# EAGLE design MotorControllerMainBoard (EAGLE 8.3.2)

## Sheet 1 of 7: Main Board Topology
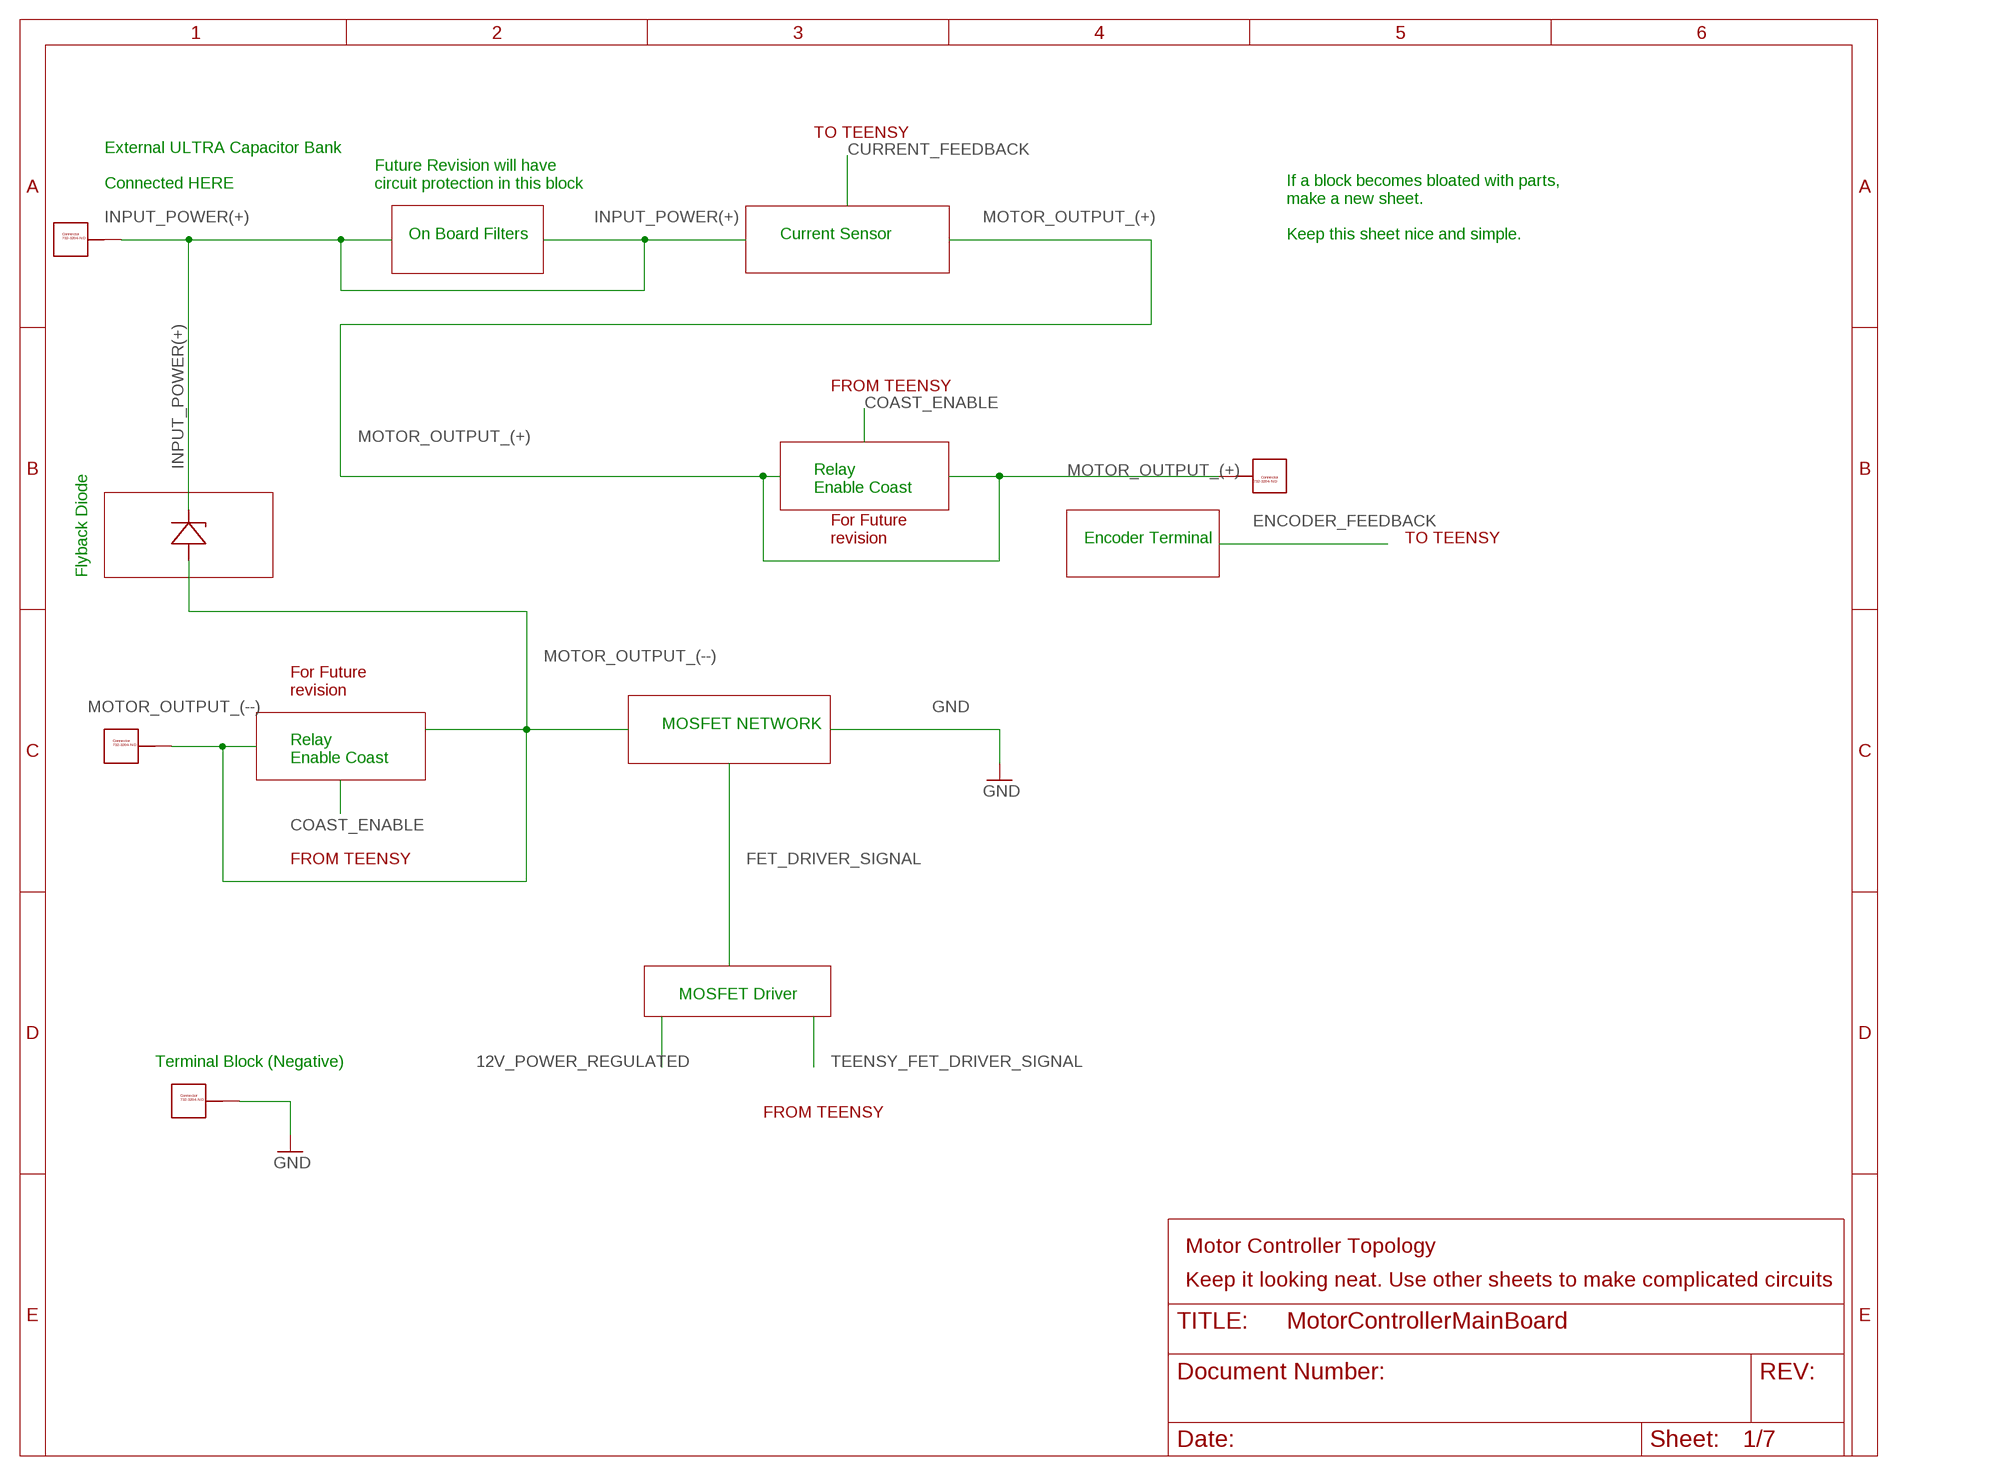
[diagram p0: schematic, sheet 1]

### Parts
U$5  FLYBACK  [TO]
U$12  732-3204-ND_CONNECTOR  [732-3204-ND]
U$14  732-3204-ND_CONNECTOR  [732-3204-ND]
U$15  732-3204-ND_CONNECTOR  [732-3204-ND]
U$16  732-3204-ND_CONNECTOR  [732-3204-ND]

### Nets
GND: U$14.P$1 U$14.P$2 U$14.P$3 U$14.P$4 U$14.P$5 U$14.P$6 U$14.P$7 U$14.P$8 U$14.P$9 U$14.P$10 ; also sheet 2,3,4,5,6,7
INPUT_POWER(+): U$5.CATHODE U$12.P$1 U$12.P$2 U$12.P$3 U$12.P$4 U$12.P$5 U$12.P$6 U$12.P$7 U$12.P$8 U$12.P$9 U$12.P$10 ; also sheet 6,7
MOTOR_OUTPUT_(+): U$15.P$1 U$15.P$2 U$15.P$3 U$15.P$4 U$15.P$5 U$15.P$6 U$15.P$7 U$15.P$8 U$15.P$9 U$15.P$10 ; also sheet 4,5
MOTOR_OUTPUT_(--): U$5.ANODE U$16.P$1 U$16.P$2 U$16.P$3 U$16.P$4 U$16.P$5 U$16.P$6 U$16.P$7 U$16.P$8 U$16.P$9 U$16.P$10 ; also sheet 2

### Notes on the sheet
- TO TEENSY
- External ULTRA Capacitor Bank 
  
  Connected HERE
- Future Revision will have 
  circuit protection in this block
- On Board Filters | Current Sensor
- If a block becomes bloated with parts,
  make a new sheet. 
  
  Keep this sheet nice and simple.
- FROM TEENSY
- Relay
  Enable Coast
- For Future
  revision
- Encoder Terminal | TO TEENSY
- Flyback Diode
- For Future
  revision
- MOSFET NETWORK
- Relay
  Enable Coast
- FROM TEENSY
- MOSFET Driver
- Terminal Block (Negative)
- FROM TEENSY
- Motor Controller Topology
- Keep it looking neat. Use other sheets to make complicated circuits

## Sheet 2 of 7: MOSFET NETWORK
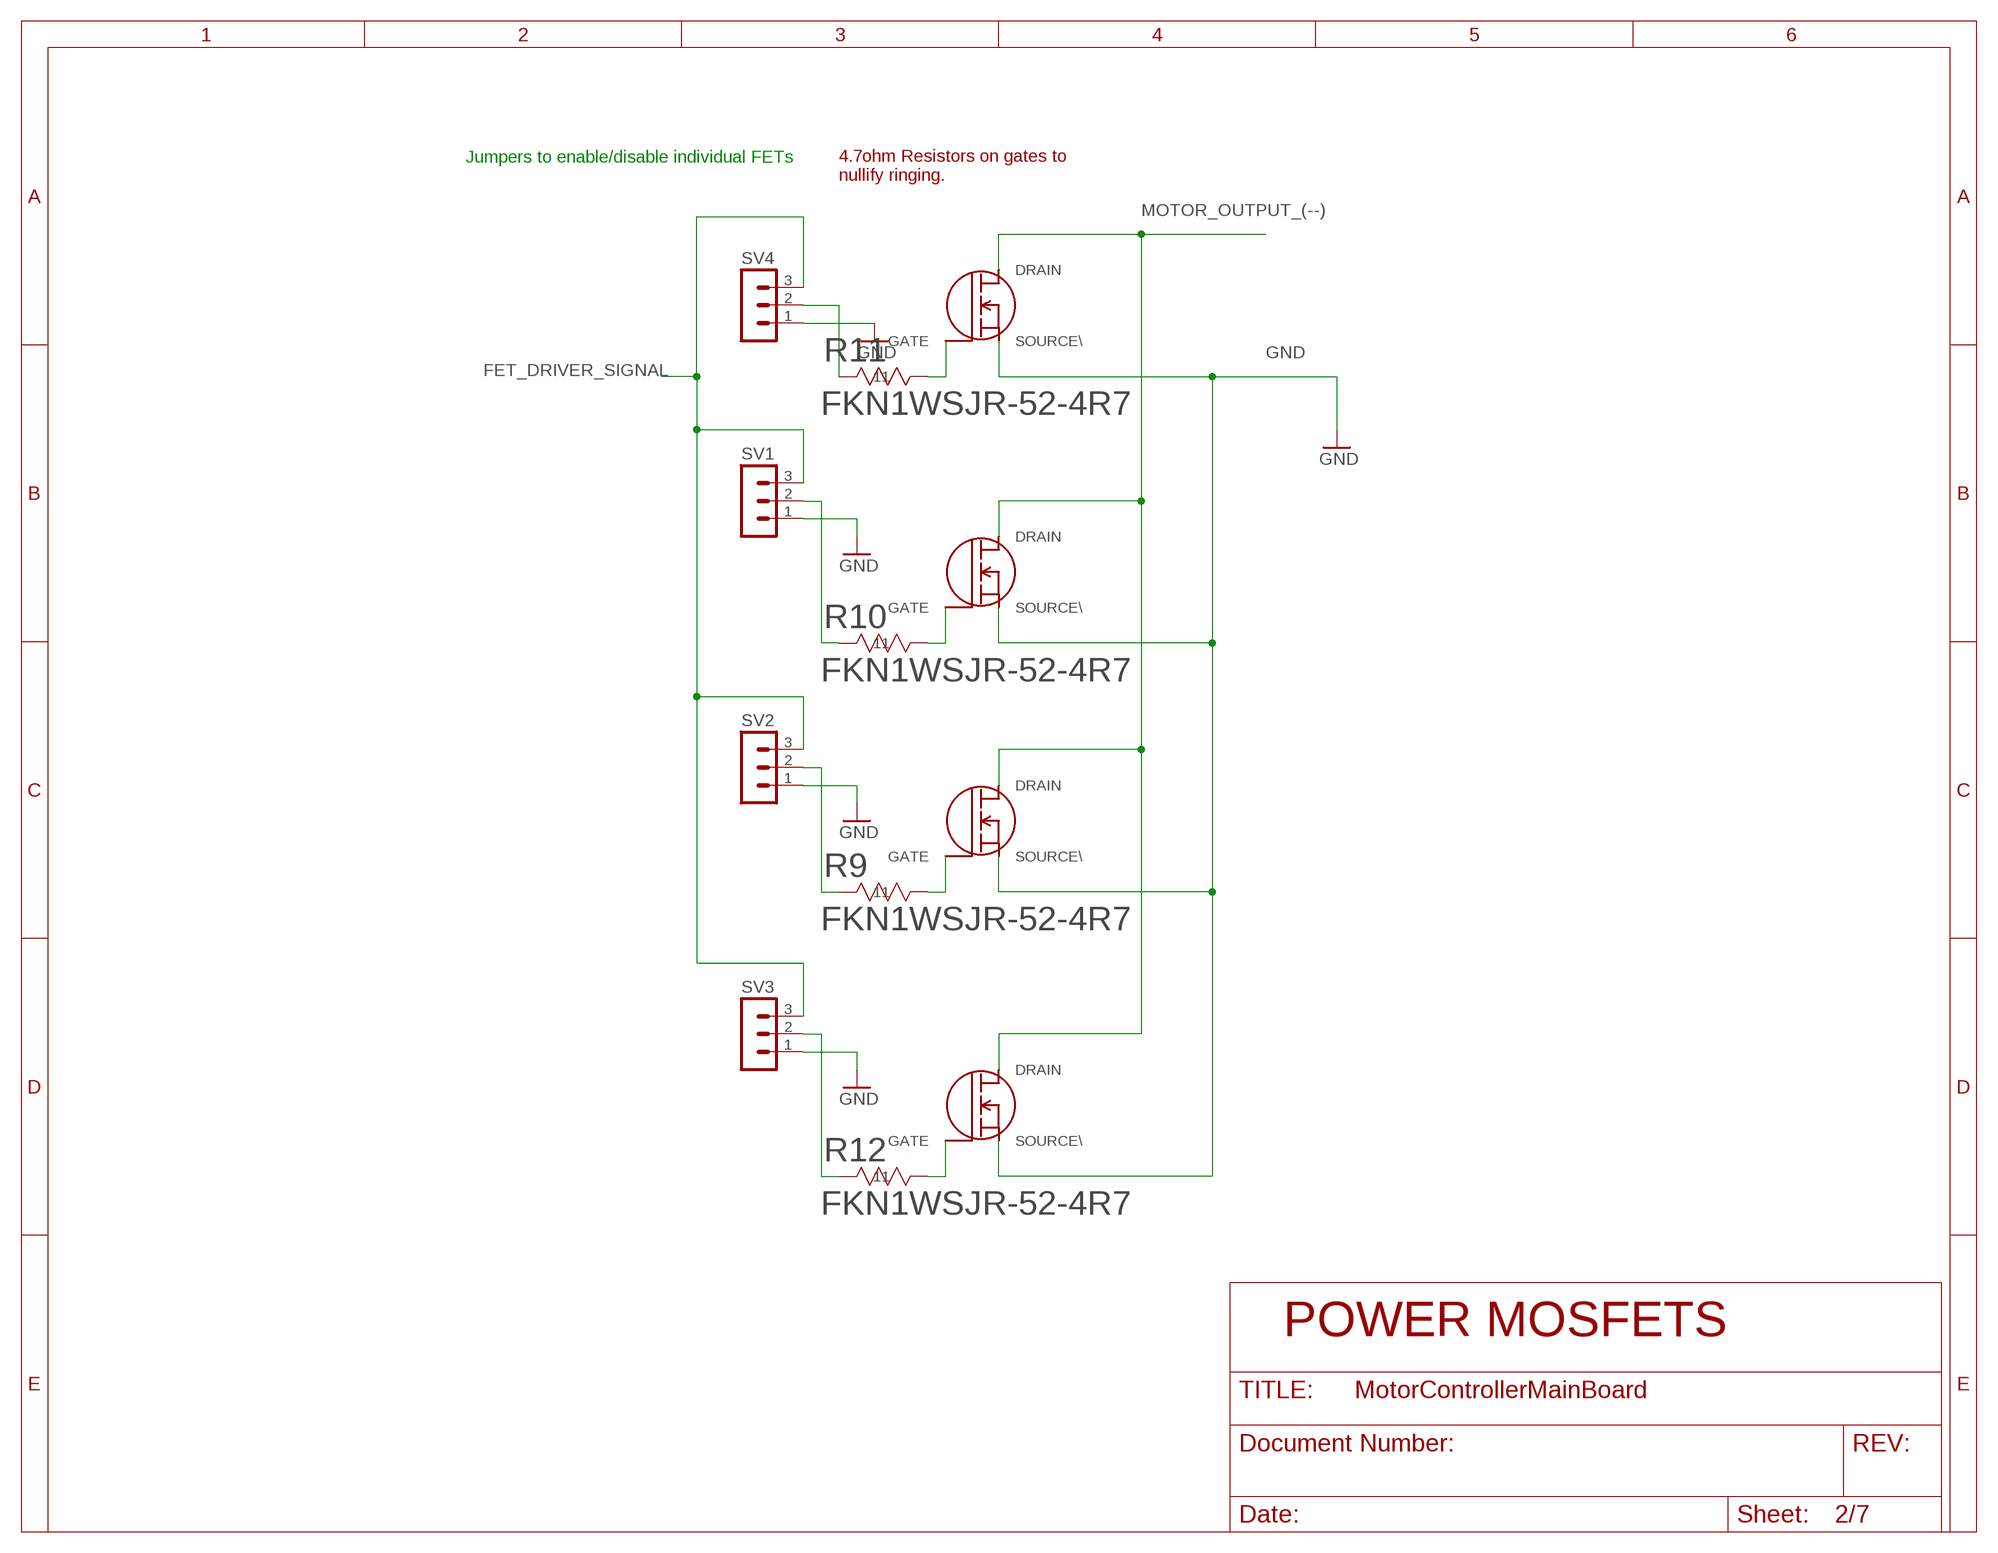
[diagram p1: schematic, sheet 2]

### Parts
R9  FKN1WSJR-52-4R7  [YAG_FKN50]
R10  FKN1WSJR-52-4R7  [YAG_FKN50]
R11  FKN1WSJR-52-4R7  [YAG_FKN50]
R12  FKN1WSJR-52-4R7  [YAG_FKN50]
SV1  MA03-1  [MA03-1]
SV2  MA03-1  [MA03-1]
SV3  MA03-1  [MA03-1]
SV4  MA03-1  [MA03-1]
U$1  NTMFS5C426NT1G  [DNF5]
U$2  NTMFS5C426NT1G  [DNF5]
U$3  NTMFS5C426NT1G  [DNF5]
U$4  NTMFS5C426NT1G  [DNF5]

### Nets
FET_DRIVER_SIGNAL: SV1.3 SV2.3 SV3.3 SV4.3 ; also sheet 1,3
GND: SV1.1 SV2.1 SV3.1 U$1.SOURCE(SOURCE\) U$2.SOURCE(SOURCE\) U$3.SOURCE(SOURCE\) U$4.SOURCE(SOURCE\) ; also sheet 1,3,4,5,6,7
MOTOR_OUTPUT_(--): U$1.DRAIN U$2.DRAIN U$3.DRAIN U$4.DRAIN ; also sheet 1
N$2: R10.2 U$2.GATE
N$3: R10.1 SV1.2
N$5: R12.1 SV3.2
N$8: R11.1 SV4.2
N$10: R11.2 U$1.GATE
N$11: R9.2 U$3.GATE
N$12: R12.2 U$4.GATE
N$13: R9.1 SV2.2
Unconnected: SV4.1

### Notes on the sheet
- Jumpers to enable/disable individual FETs
- 4.7ohm Resistors on gates to
  nullify ringing.
- POWER MOSFETS

## Sheet 3 of 7: MOSFET Driver
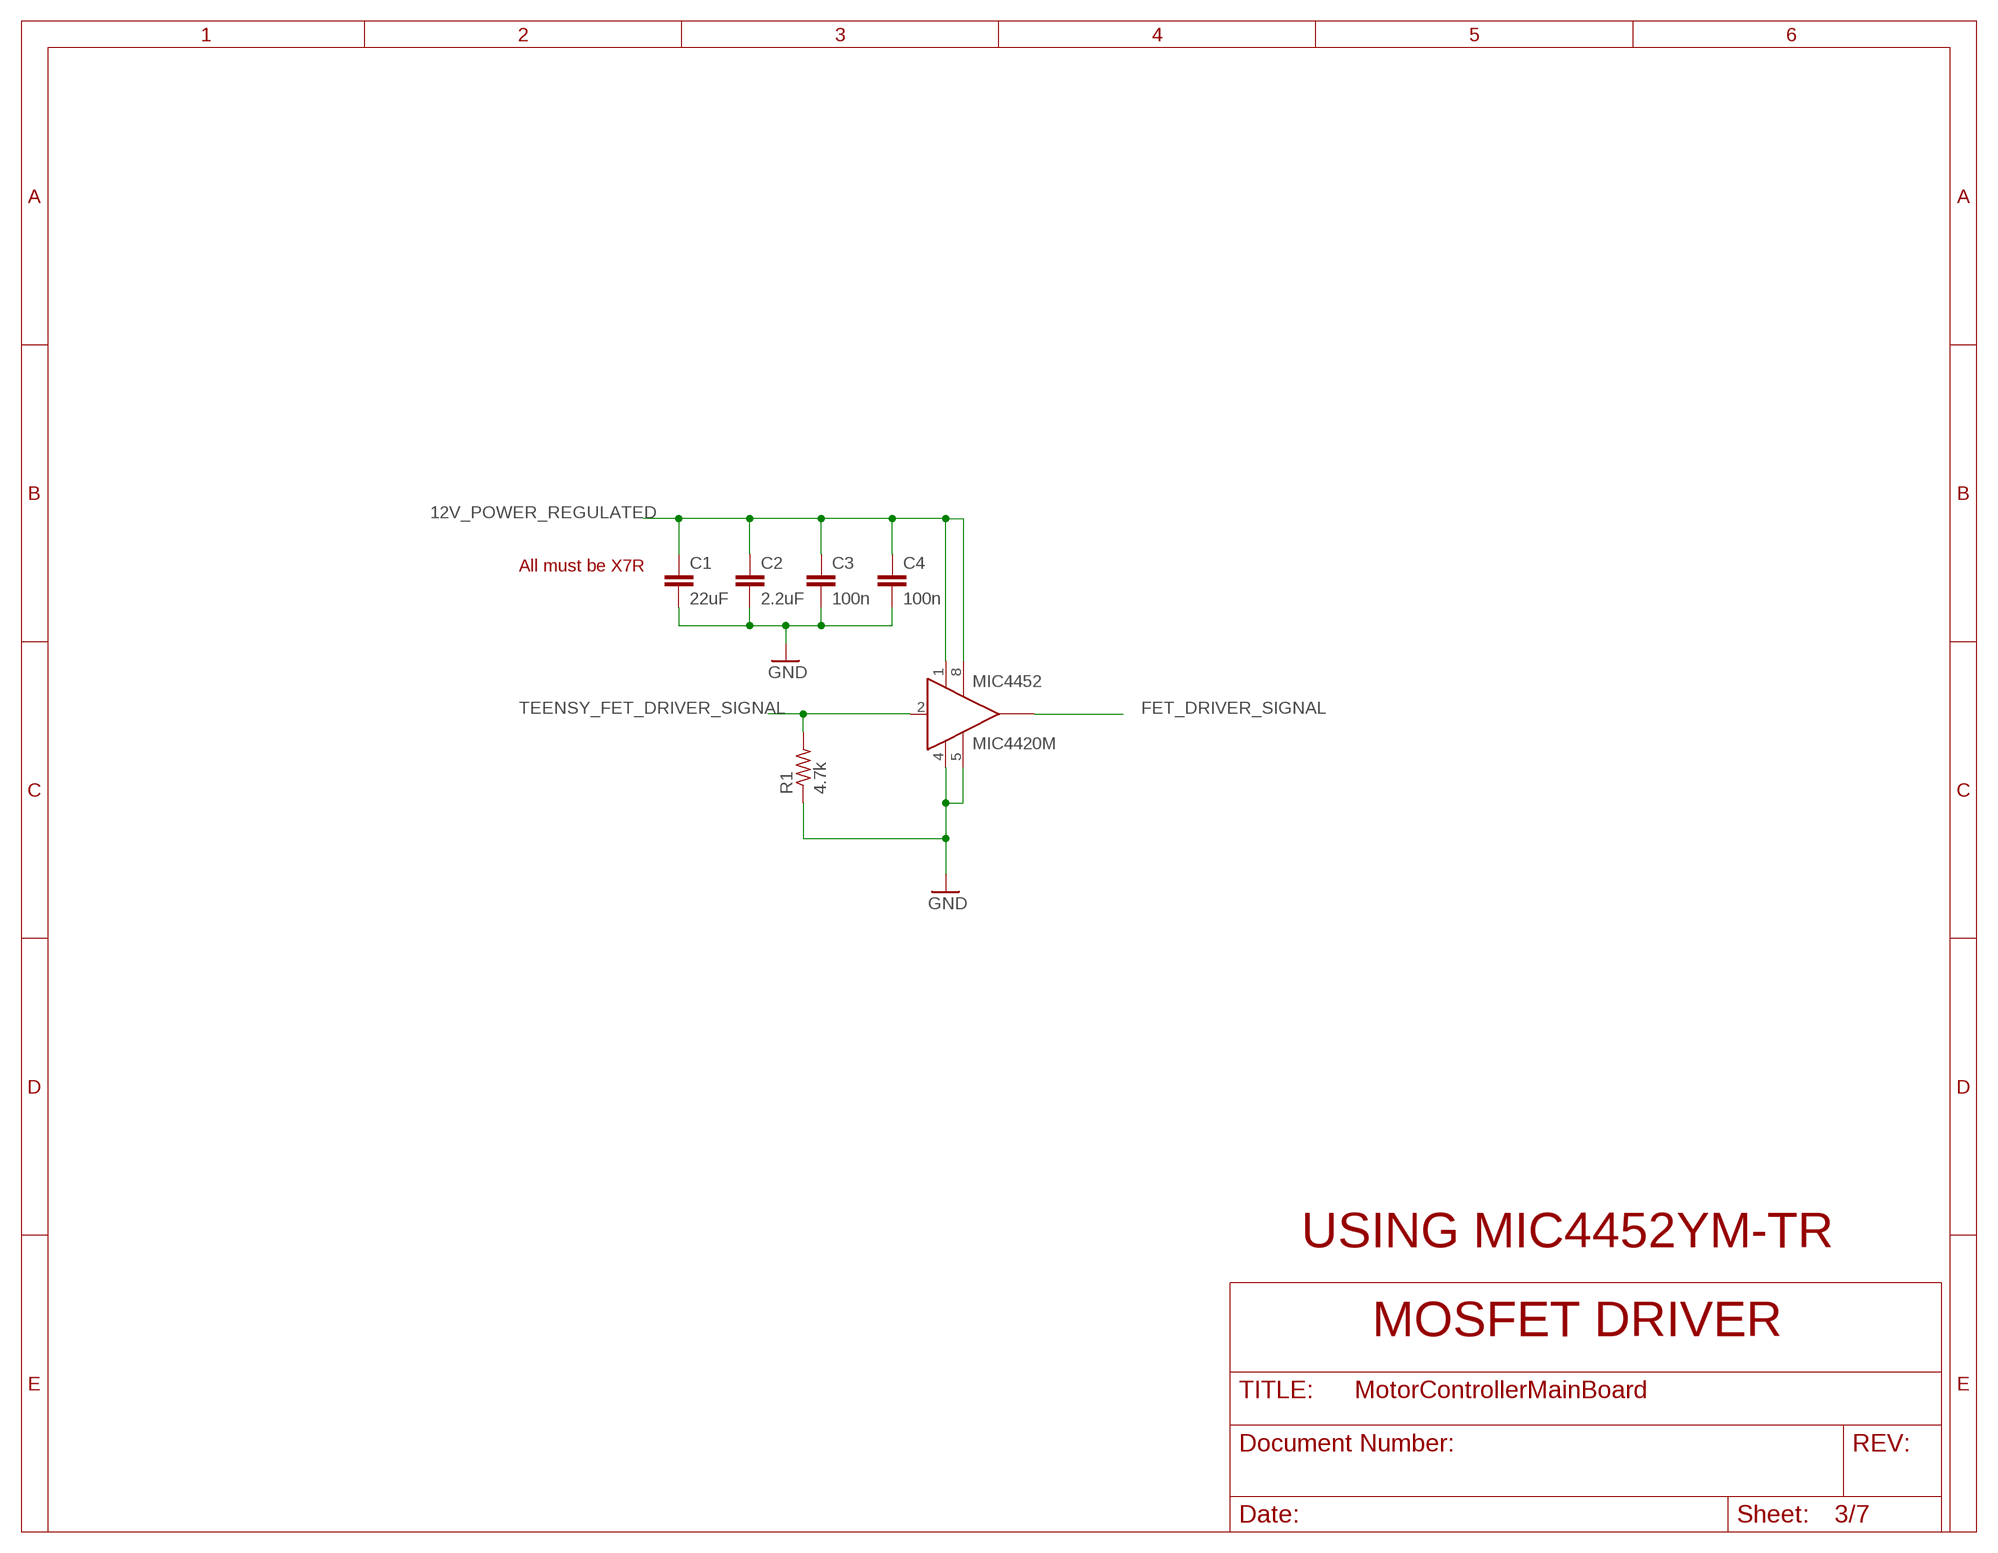
[diagram p2: schematic, sheet 3]

### Parts
C1  22uF  C-EUC1206  [C1206]
C2  2.2uF  C-EUC0805  [C0805]
C3  100n  C-EUC0603  [C0603]
C4  100n  C-EUC0603  [C0603]
MIC4452  MIC4420M  [SO-08]
R1  4.7k  R-US_R0805  [R0805]

### Nets
12V_POWER_REGULATED: C1.1 C2.1 C3.1 C4.1 MIC4452.1(VS) MIC4452.8(VS1) ; also sheet 1,5,7
FET_DRIVER_SIGNAL: MIC4452.6(OUT) ; also sheet 1,2
GND: C1.2 C2.2 C3.2 C4.2 MIC4452.4(GND) MIC4452.5(GND1) R1.1 ; also sheet 1,2,4,5,6,7
TEENSY_FET_DRIVER_SIGNAL: MIC4452.2(IN) R1.2 ; also sheet 1,7
Unconnected: MIC4452.7(OUT)

### Notes on the sheet
- All must be X7R
- USING MIC4452YM-TR
- MOSFET DRIVER

## Sheet 4 of 7: Current Sensor
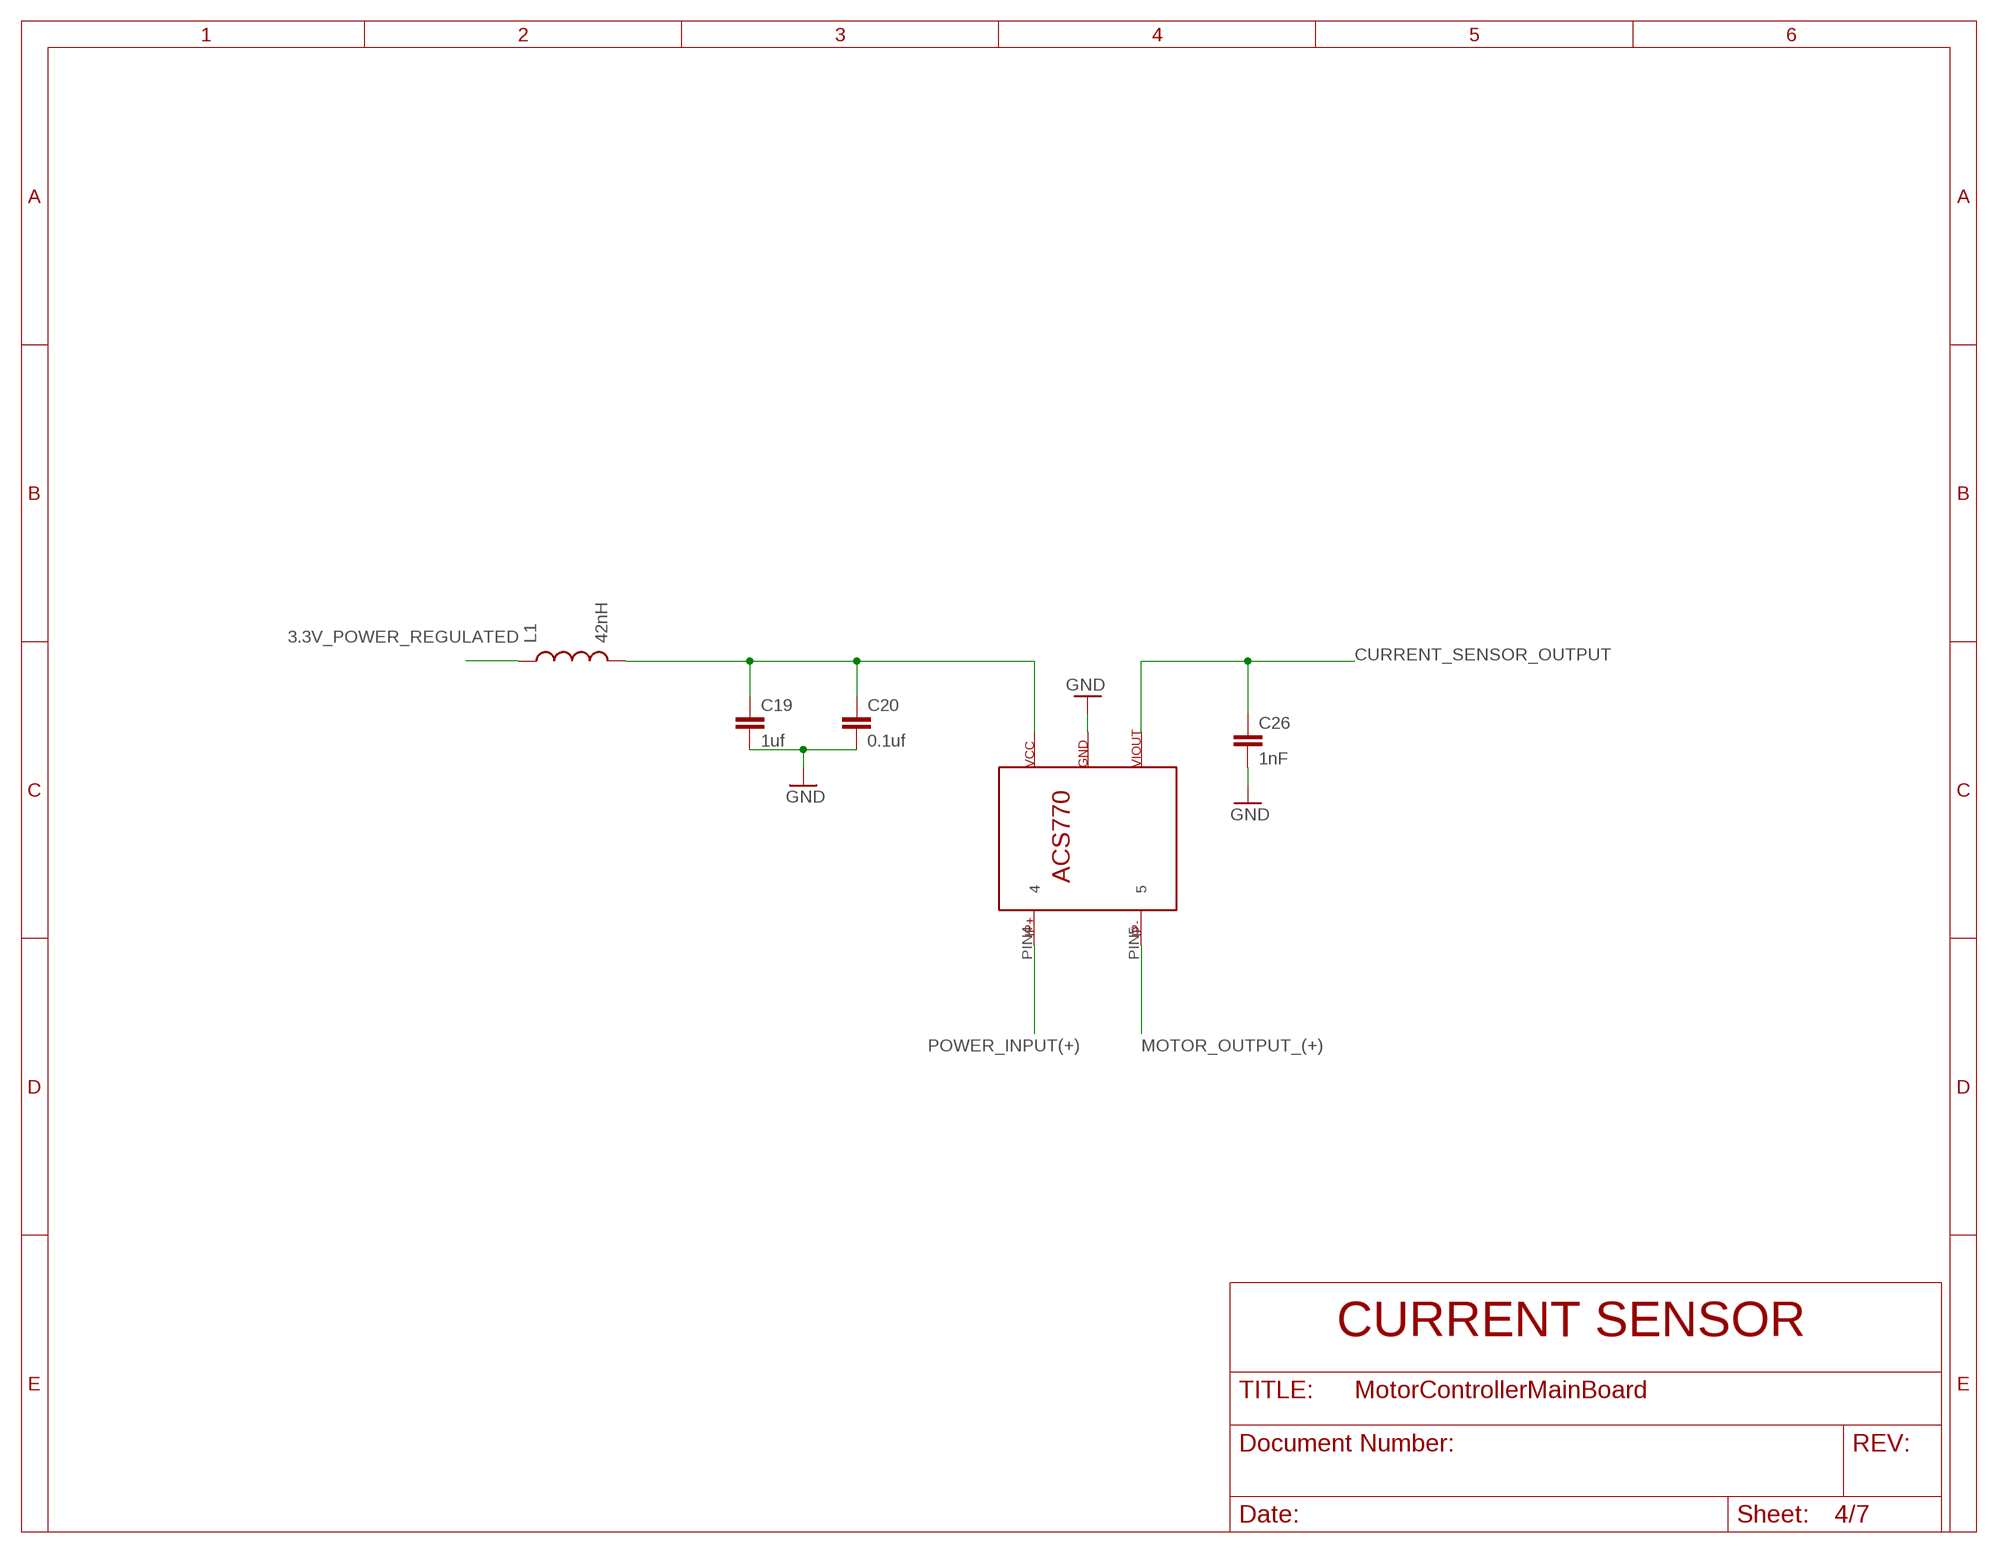
[diagram p3: schematic, sheet 4]

### Parts
C19  1uf  C-EUC0805  [C0805]
C20  0.1uf  C-EUC0805  [C0805]
C26  1nF  C-EUC0805  [C0805]
L1  42nH  INDUCTOR0805  [0805]
U$9  ACS770LCB_CURRENTSENSOR  [ACS770LCB_CURRENTSENSOR]

### Nets
3.3V_POWER_REGULATED: L1.1 ; also sheet 7
CURRENT_SENSOR_OUTPUT: C26.1 U$9.PIN3 ; also sheet 7
GND: C19.2 C20.2 C26.2 U$9.PIN2 ; also sheet 1,2,3,5,6,7
MOTOR_OUTPUT_(+): U$9.PIN5 ; also sheet 1,5
N$6: C19.1 C20.1 L1.2 U$9.PIN1
POWER_INPUT(+): U$9.PIN4

### Notes on the sheet
- CURRENT SENSOR

## Sheet 5 of 7: Power Supply
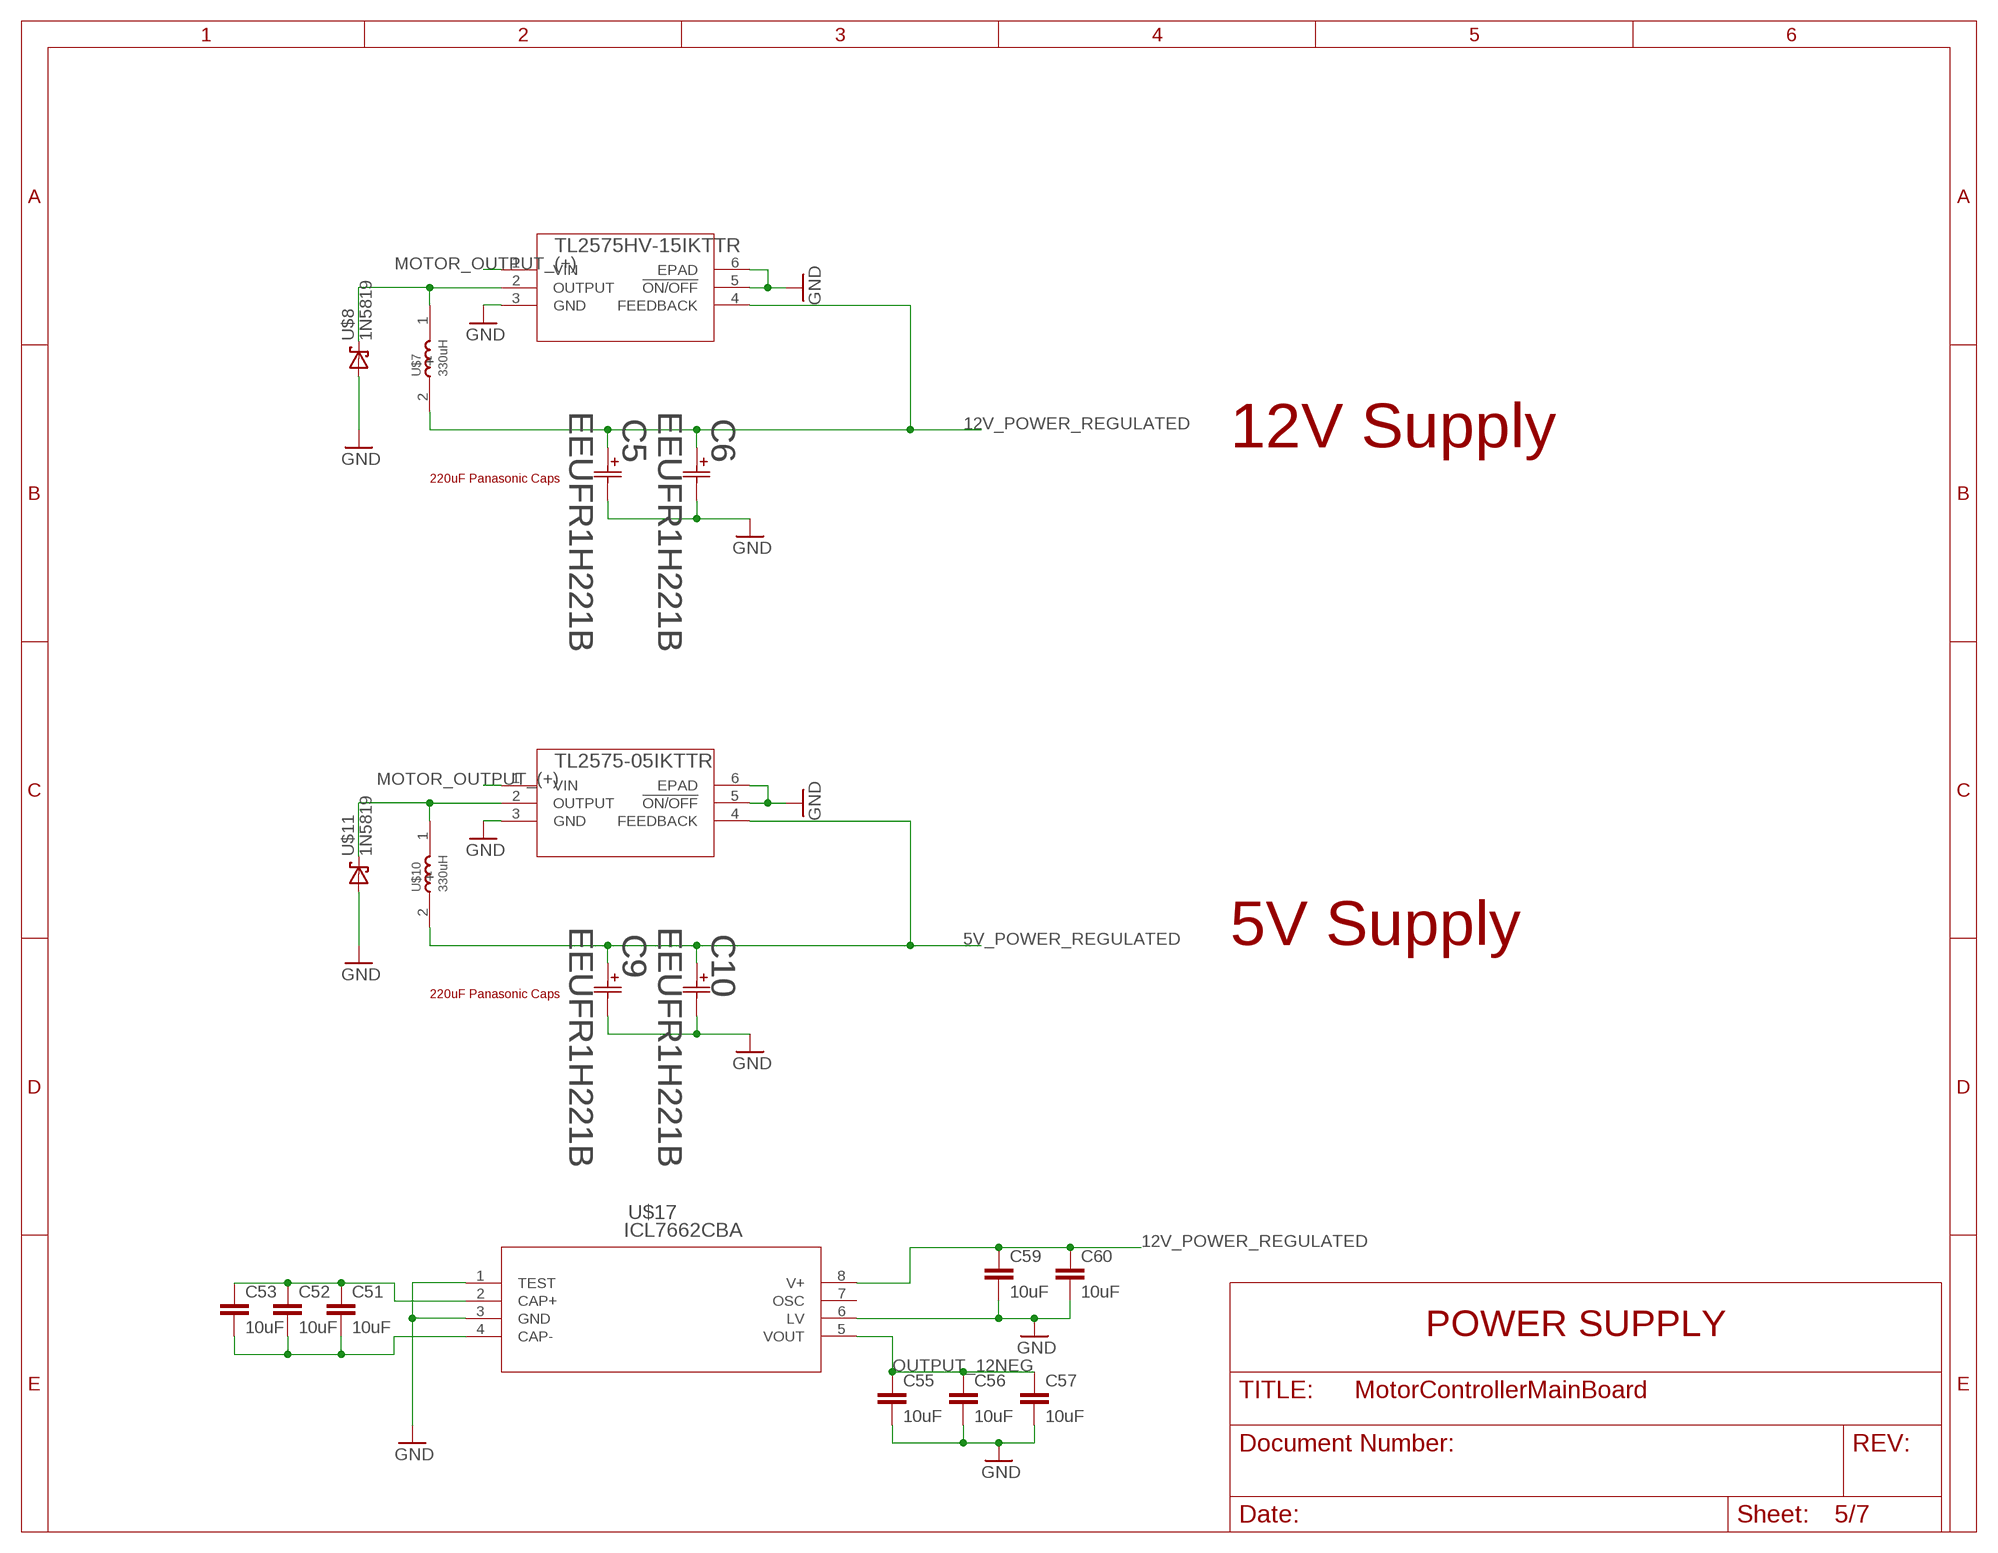
[diagram p4: schematic, sheet 5]

### Parts
C5  EEUFR1H221B  [CAP_PAN_10X16]
C6  EEUFR1H221B  [CAP_PAN_10X16]
C9  EEUFR1H221B  [CAP_PAN_10X16]
C10  EEUFR1H221B  [CAP_PAN_10X16]
C51  10uF  C-EUC0805  [C0805]
C52  10uF  C-EUC0805  [C0805]
C53  10uF  C-EUC0805  [C0805]
C55  10uF  C-EUC0805  [C0805]
C56  10uF  C-EUC0805  [C0805]
C57  10uF  C-EUC0805  [C0805]
C59  10uF  C-EUC0805  [C0805]
C60  10uF  C-EUC0805  [C0805]
U$6  TL2575HV-15IKTTR  [KTT5_6P22X6P86]
U$7  330uH  PA4320  [INDUCTOR_SMD_FOOTPRINT]
U$8  1N5819  [SOD3715X135N]
U$10  330uH  PA4320  [INDUCTOR_SMD_FOOTPRINT]
U$11  1N5819  [SOD3715X135N]
U$13  TL2575-05IKTTR  [KTT5_6P22X6P86]
U$17  ICL7662CBA  [SO08]

### Nets
5V_POWER_REGULATED: C9.1 C10.1 U$10.2(-) U$13.4(FEEDBACK) ; also sheet 7
12V_POWER_REGULATED: C5.1 C6.1 C59.1 C60.1 U$6.4(FEEDBACK) U$7.2(-) U$17.8(V+) ; also sheet 1,3,7
GND: C5.2 C6.2 C9.2 C10.2 C55.2 C56.2 C57.2 C59.2 C60.2 U$6.3(GND) U$6.5(!ON/OFF) U$6.6(EPAD) U$8.A U$11.A U$13.3(GND) U$13.5(!ON/OFF) U$13.6(EPAD) U$17.1(TEST) U$17.3(GND) U$17.6(LV) ; also sheet 1,2,3,4,6,7
MOTOR_OUTPUT_(+): U$6.1(VIN) U$13.1(VIN) ; also sheet 1,4
N$1: U$6.2(OUTPUT) U$7.1(+) U$8.C(K)
N$4: U$10.1(+) U$11.C(K) U$13.2(OUTPUT)
N$14: C51.1 C52.1 C53.1 U$17.2(CAP+)
N$15: C51.2 C52.2 C53.2 U$17.4(CAP-)
OUTPUT_12NEG: C55.1 C56.1 C57.1 U$17.5(VOUT) ; also sheet 7
Unconnected: U$17.7(OSC)

### Notes on the sheet
- 12V Supply
- 220uF Panasonic Caps
- 5V Supply
- 220uF Panasonic Caps
- POWER SUPPLY

## Sheet 6 of 7: Input Filters
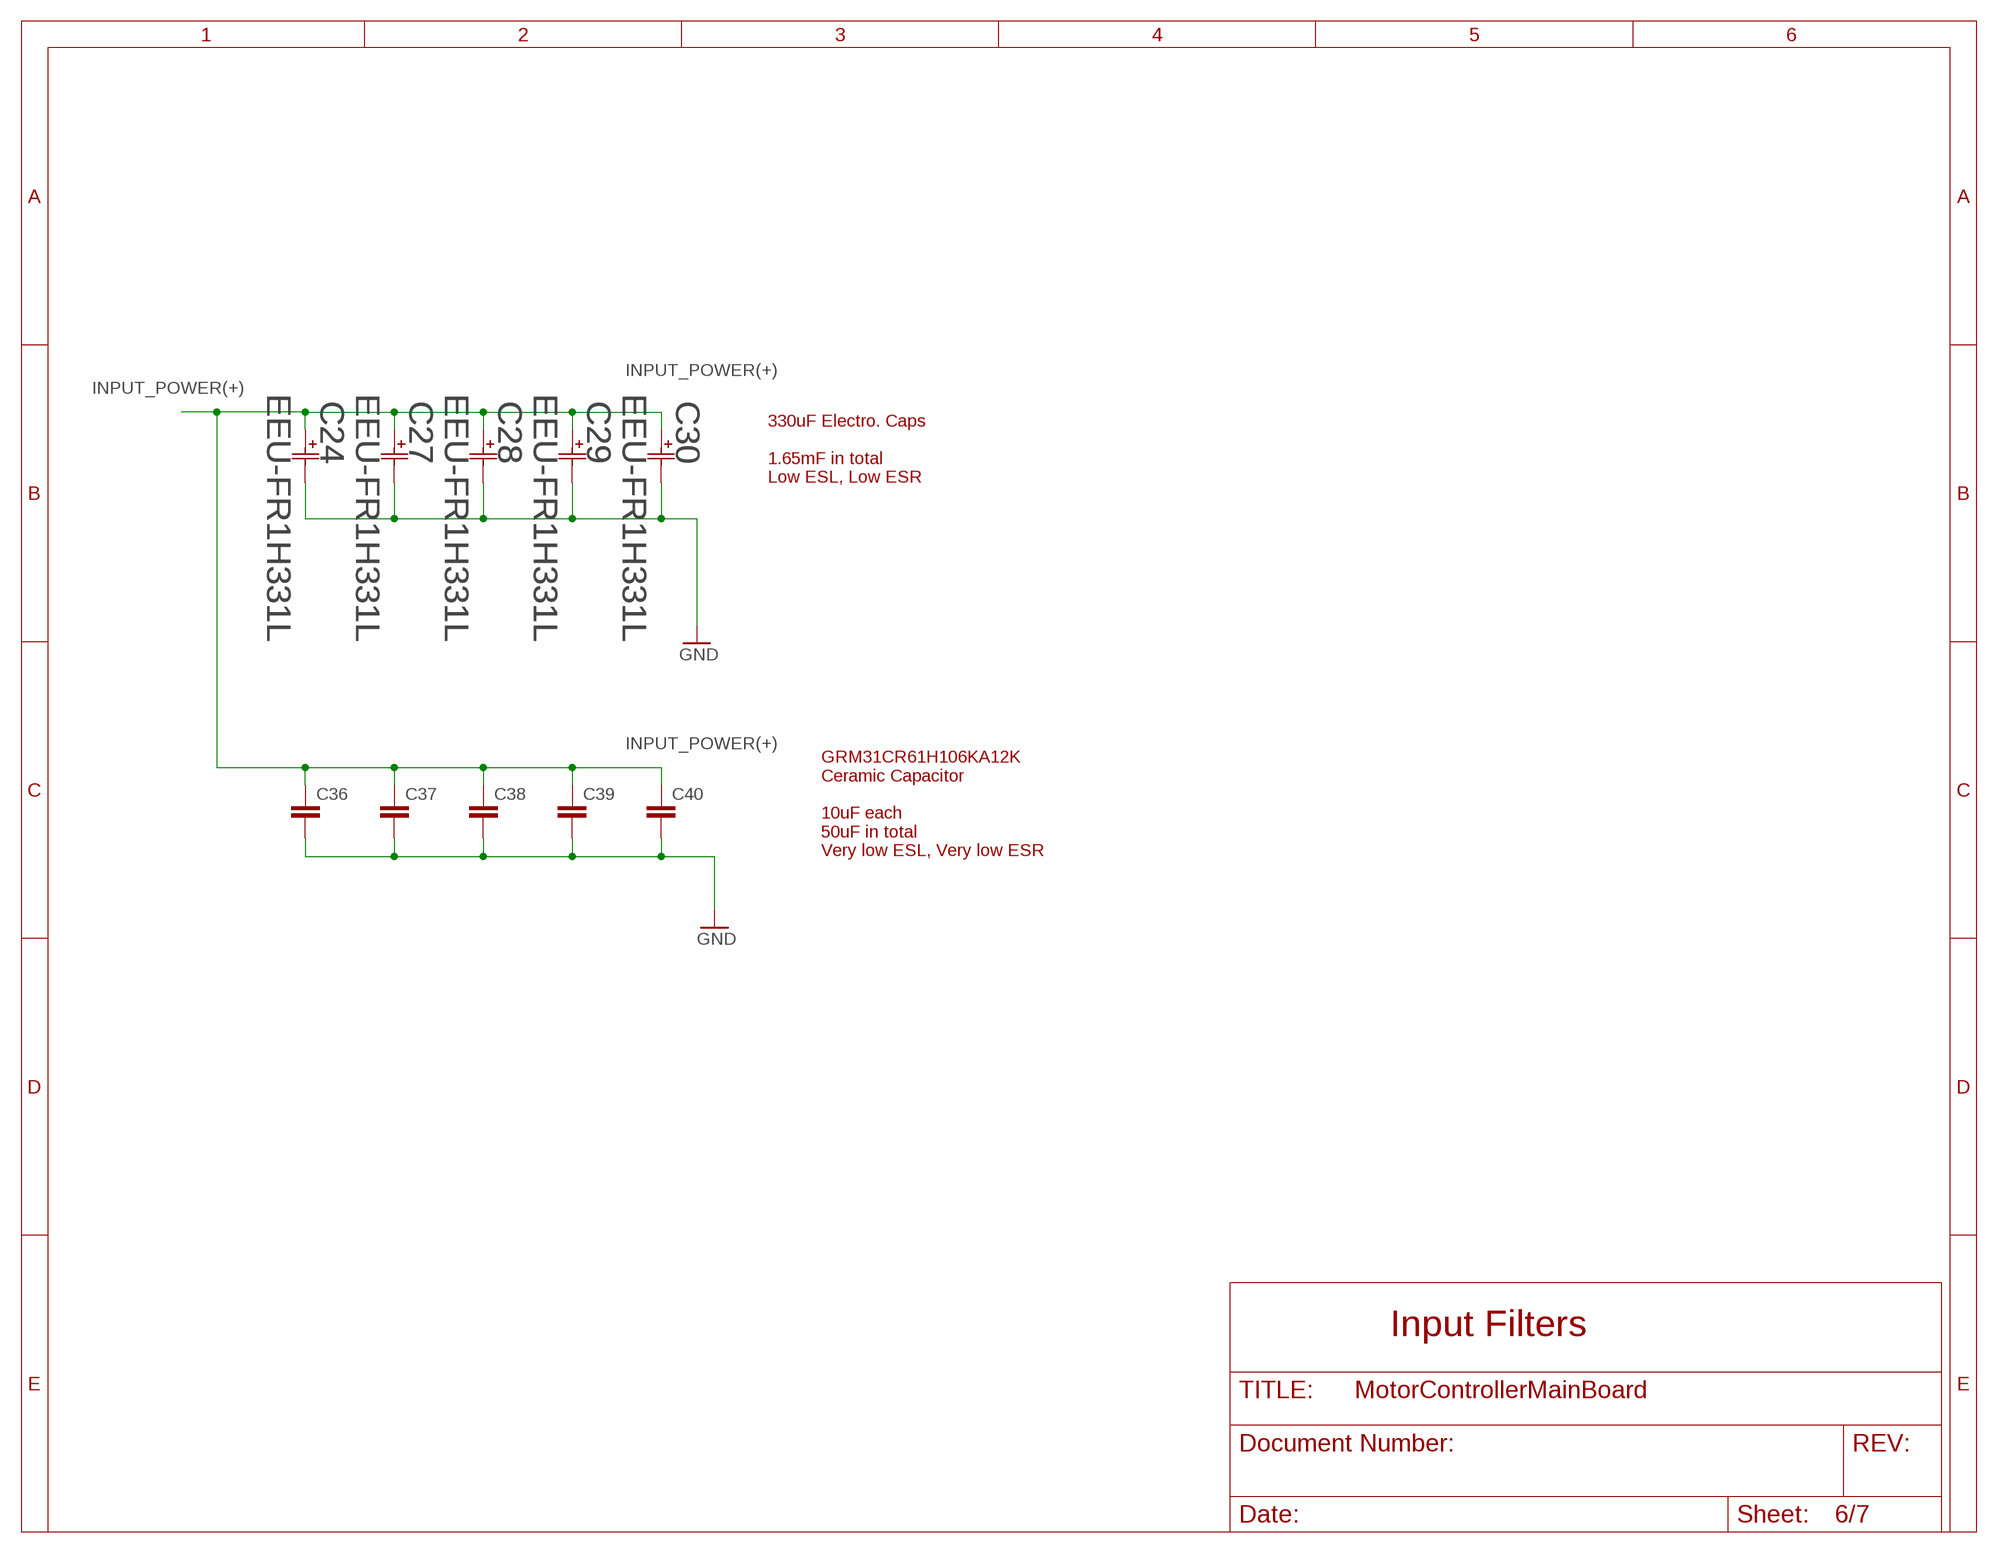
[diagram p5: schematic, sheet 6]

### Parts
C24  EEU-FR1H331L  [CAP_EEUFC_10X25]
C27  EEU-FR1H331L  [CAP_EEUFC_10X25]
C28  EEU-FR1H331L  [CAP_EEUFC_10X25]
C29  EEU-FR1H331L  [CAP_EEUFC_10X25]
C30  EEU-FR1H331L  [CAP_EEUFC_10X25]
C36  C-EUC1206  [C1206]
C37  C-EUC1206  [C1206]
C38  C-EUC1206  [C1206]
C39  C-EUC1206  [C1206]
C40  C-EUC1206  [C1206]

### Nets
GND: C24.2 C27.2 C28.2 C29.2 C30.2 C36.2 C37.2 C38.2 C39.2 C40.2 ; also sheet 1,2,3,4,5,7
INPUT_POWER(+): C24.1 C27.1 C28.1 C29.1 C30.1 C36.1 C37.1 C38.1 C39.1 C40.1 ; also sheet 1,7

### Notes on the sheet
- 330uF Electro. Caps
  
  1.65mF in total
  Low ESL, Low ESR
- GRM31CR61H106KA12K
  Ceramic Capacitor
  
  10uF each
  50uF in total
  Very low ESL, Very low ESR
- Input Filters

## Sheet 7 of 7: Teensy
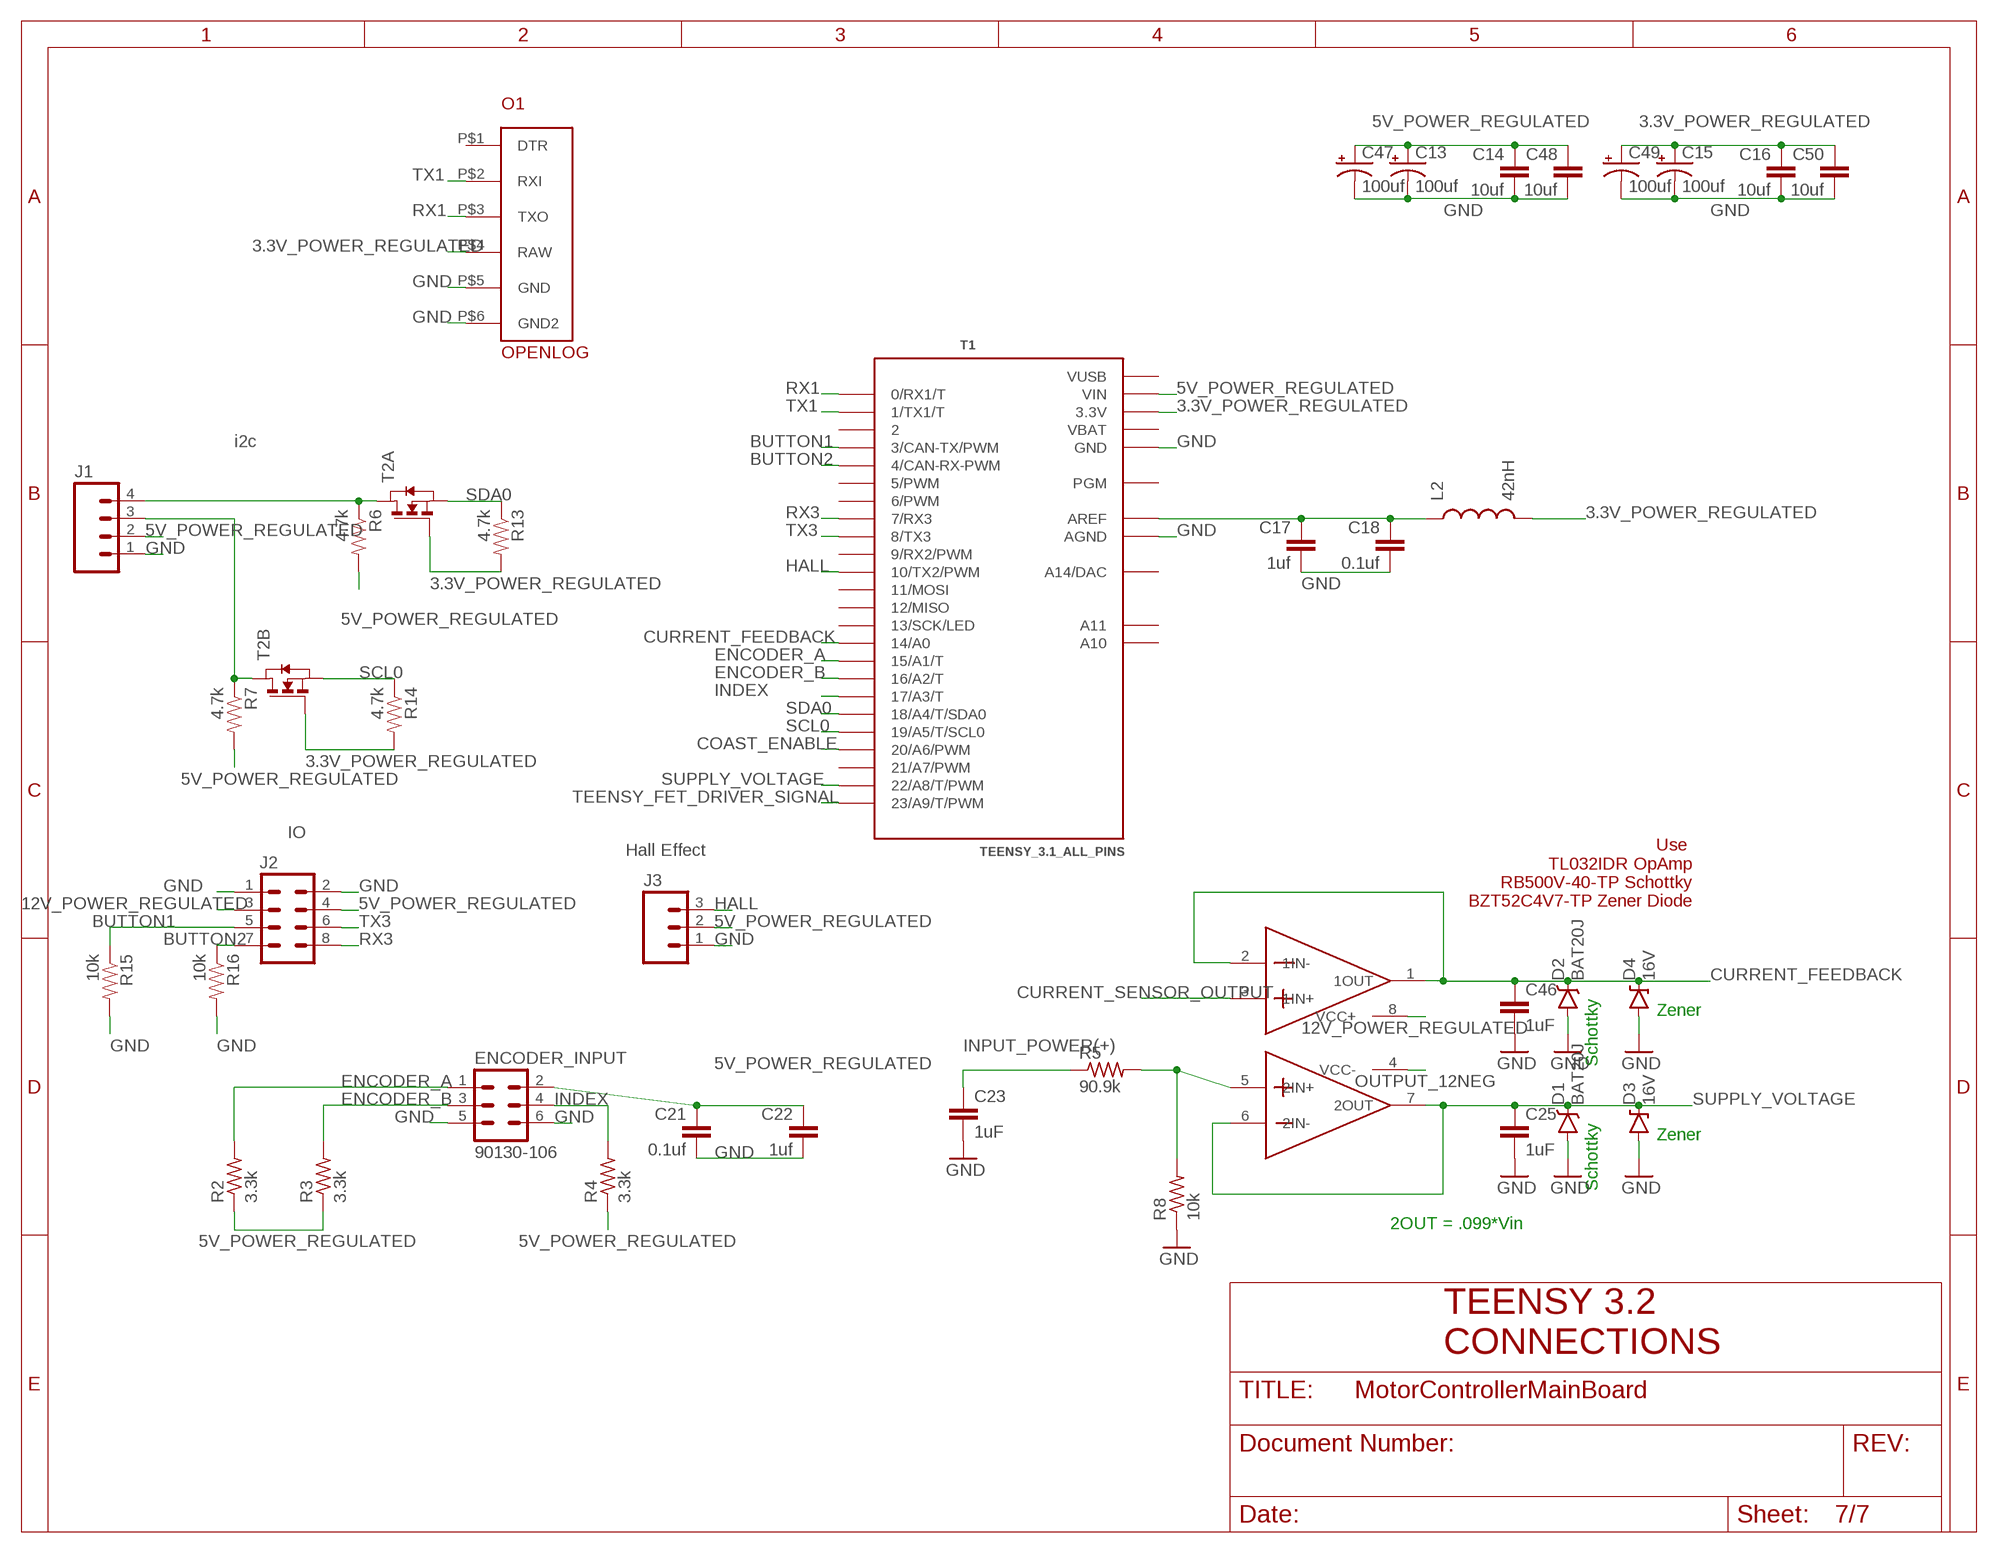
[diagram p6: schematic, sheet 7]

### Parts
AD8512ARZ  TL072CDT  [D8]
C13  100uf  CAP_POLC  [PANASONIC_C]
C14  10uf  C-EUC0805  [C0805]
C15  100uf  CAP_POLC  [PANASONIC_C]
C16  10uf  C-EUC0805  [C0805]
C17  1uf  C-EUC0805  [C0805]
C18  0.1uf  C-EUC0805  [C0805]
C21  0.1uf  C-EUC0805  [C0805]
C22  1uf  C-EUC0805  [C0805]
C23  1uF  C-EUC0805  [C0805]
C25  1uF  C-EUC0805  [C0805]
C46  1uF  C-EUC0805  [C0805]
C47  100uf  CAP_POLC  [PANASONIC_C]
C48  10uf  C-EUC0805  [C0805]
C49  100uf  CAP_POLC  [PANASONIC_C]
C50  10uf  C-EUC0805  [C0805]
D1  BAT20J  DIODE-SCHOTTKY-BAT20J  [SOD-323]
D2  BAT20J  DIODE-SCHOTTKY-BAT20J  [SOD-323]
D3  16V  DIODE-ZENER16V  [SOD-123]
D4  16V  DIODE-ZENER16V  [SOD-123]
ENCODER_INPUT  90130-106  [90130-1?06]
J1  M04PTH  [1X04]
J2  M04X2  [2X4]
J3  M03PTH  [1X03]
L2  42nH  INDUCTOR0805  [0805]
O1  OPENLOG  [OPENLOG]
R2  3.3k  R-US_R0805  [R0805]
R3  3.3k  R-US_R0805  [R0805]
R4  3.3k  R-US_R0805  [R0805]
R5  90.9k  R-US_R0805  [R0805]
R6  4.7k  RESISTOR0805-RES  [0805]
R7  4.7k  RESISTOR0805-RES  [0805]
R8  10k  R-US_R0805  [R0805]
R13  4.7k  RESISTOR0805-RES  [0805]
R14  4.7k  RESISTOR0805-RES  [0805]
R15  10k  RESISTOR0805-RES  [0805]
R16  10k  RESISTOR0805-RES  [0805]
T1  TEENSY_3.1_ALL_PINS  [TEENSY3-ALL_PINS]
T2  NMOS2SO8  [SO8]

### Nets
3.3V_POWER_REGULATED: C15.+ C16.1 C49.+ C50.1 L2.2 O1.P$4(RAW) R13.2 R14.2 T1.3.3V T1.3.3V1(3.3V) T2.2(A:G) T2.4(B:G) ; also sheet 4
5V_POWER_REGULATED: C13.+ C14.1 C21.1 C22.1 C47.+ C48.1 ENCODER_INPUT.2 J1.2 J2.4 J3.2 R2.1 R3.1 R4.1 R6.2 R7.2 T1.VIN ; also sheet 5
12V_POWER_REGULATED: AD8512ARZ.8(VCC+) J2.3 ; also sheet 1,3,5
BUTTON1: J2.5 R15.1 T1.3(3/CAN-TX/PWM)
BUTTON2: J2.7 R16.1 T1.4(4/CAN-RX-PWM)
COAST_ENABLE: T1.20/A6(20/A6/PWM) ; also sheet 1
CURRENT_FEEDBACK: AD8512ARZ.1(1OUT) AD8512ARZ.2(1IN-) C46.1 D2.C D4.C T1.14/A0 ; also sheet 1
CURRENT_SENSOR_OUTPUT: AD8512ARZ.3(1IN+) ; also sheet 4
ENCODER_A: ENCODER_INPUT.1 R2.2 T1.15/A1(15/A1/T)
ENCODER_B: ENCODER_INPUT.3 R3.2 T1.16/A2(16/A2/T)
GND: C13.- C14.2 C15.- C16.2 C17.2 C18.2 C21.2 C22.2 C23.2 C25.2 C46.2 C47.- C48.2 C49.- C50.2 D1.A D2.A D3.A D4.A ENCODER_INPUT.5 ENCODER_INPUT.6 J1.1 J2.1 J2.2 J3.1 O1.P$5(GND) O1.P$6(GND2) R8.1 R15.2 R16.2 T1.AGND T1.GND T1.GND1(GND) ; also sheet 1,2,3,4,5,6
HALL: J3.3 T1.10(10/TX2/PWM)
INDEX: ENCODER_INPUT.4 R4.2 T1.17/A3(17/A3/T)
INPUT_POWER(+): C23.1 R5.1 ; also sheet 1,6
N$7: AD8512ARZ.5(2IN+) R5.2 R8.2
N$9: C17.1 C18.1 L2.1 T1.AREF
N$19: J1.3 R7.1 T2.5(B:D) T2.6(B:D)
N$20: J1.4 R6.1 T2.7(A:D) T2.8(A:D)
OUTPUT_12NEG: AD8512ARZ.4(VCC-) ; also sheet 5
RX1: O1.P$3(TXO) T1.0(0/RX1/T)
RX3: J2.8 T1.7(7/RX3)
SCL0: R14.1 T1.19/A5(19/A5/T/SCL0) T2.3(B:S)
SDA0: R13.1 T1.18/A4(18/A4/T/SDA0) T2.1(A:S)
SUPPLY_VOLTAGE: AD8512ARZ.6(2IN-) AD8512ARZ.7(2OUT) C25.1 D1.C D3.C T1.22/A8(22/A8/T/PWM)
TEENSY_FET_DRIVER_SIGNAL: T1.23/A9(23/A9/T/PWM) ; also sheet 1,3
TX1: O1.P$2(RXI) T1.1(1/TX1/T)
TX3: J2.6 T1.8(8/TX3)
Unconnected: O1.P$1(DTR) T1.2 T1.5(5/PWM) T1.6(6/PWM) T1.9(9/RX2/PWM) T1.11(11/MOSI) T1.12(12/MISO) T1.13(13/SCK/LED) T1.21/A7(21/A7/PWM) T1.A10 T1.A11 T1.PGM T1.RESET/DAC(A14/DAC)

### Notes on the sheet
- i2c
- IO
- Use 
  TL032IDR OpAmp
  RB500V-40-TP Schottky
  BZT52C4V7-TP Zener Diode
- Hall Effect
- Schottky
- Zener
- Schottky
- Zener
- 2OUT = .099*Vin
- TEENSY 3.2
  CONNECTIONS

## Power pins joined to a net without a drawn wire
VBAT: T1.VBAT
VUSB: T1.VUSB

## Library data of the parts
AD8512ARZ = MotorControllerEagleLibrary:TL072CDT; MANUFACTURER_PART_NUMBER: TL072CDT; VENDOR: Texas Instruments
C1-C4 C23 C25 C46 = rcl:C-EU: CAPACITOR, European symbol
C5 C6 C9 C10 = MotorControllerEagleLibrary:EEUFR1H221B: Panasonic Capacitor, Digikey number P15375CT-ND; MANUFACTURER_PART_NUMBER: EEUFR1H221B; VENDOR: PANASONIC
C13 C15 C47 C49 = SparkFun-Capacitors:CAP_POL: Capacitor Polarized These are standard SMD and PTH capacitors. Normally 10uF, 47uF, and 100uF in electrolytic and tantalum varieties. Always verify the external diameter of the through hole cap, it varies with capacity, voltage, and manufacturer. The EIA devices should be standard.
C14 C16-C22 C26 C36-C40 C48 C50-C53 C55-C57 C59 C60 = resistor:C-EU: CAPACITOR, European symbol
C24 C27-C30 = MotorControllerEagleLibrary:EEU-FR1H331L; MANUFACTURER_PART_NUMBER: EEUFR1H331L; VENDOR: Panasonic
D1 D2 = SparkFun-DiscreteSemi:DIODE-SCHOTTKY: Schottky diodes in SFE's production catalog BAT20J 1A 23V 0.62Vf RB751 120mA 40V 0.37Vf PMEG4005EJ 0.5A 40V 0.42Vf MBRA140 1A 40V 0.5Vf B340A 3A 40V SMA; PROD_ID: DIO-11623
D3 D4 = SparkFun-DiscreteSemi:DIODE-ZENER: Zener Diode Production Part - 8199 3.4V Zener Voltage; PROD_ID: DIO-12440
ENCODER_INPUT = con-molex-c-grid:90130-1?06: C-Grid III
J1 = SparkFun-Connectors:M04: Header 4 Standard 4-pin 0.1" header. Use with straight break away headers (SKU : PRT-00116), right angle break away headers (PRT-00553), swiss pins (PRT-00743), machine pins (PRT-00117), and female headers (PRT-00115). Molex polarized connector foot print use with SKU : PRT-08231 with associated crimp pins and housings. 1MM SMD Version SKU: PRT-10208; PROD_ID: CONN-09696
J2 = SparkFun-Connectors:M04X2: .1" header, two rows of four.
J3 = SparkFun-Connectors:M03: Header 3 Standard 3-pin 0.1" header. Use with straight break away headers (SKU : PRT-00116), right angle break away headers (PRT-00553), swiss pins (PRT-00743), machine pins (PRT-00117), and female headers (PRT-00115). Molex polarized connector foot print use with SKU : PRT-08232 with associated crimp pins and housings.
L1 L2 = SparkFun (2015_10_14 22_27_04 UTC):INDUCTOR: Inductors Basic Inductor/Choke - 0603 and 1206. Footprints are not proven and vary greatly between part numbers.
MIC4452 = transistor-power:MIC4420: 6A-Peak Low-Side MOSFET Driver Bipolar/CMOS/DMOS Process http://www.micrel.com/_PDF/mic4420.pdf
O1 = openlog:OPENLOG
R1-R4 = resistor:R-US_: RESISTOR, American symbol
R5 R8 = rcl:R-US_: RESISTOR, American symbol
R6 R7 R13-R16 = SparkFun-Passives:RESISTOR: Resistor Basic schematic elements and footprints for 0603, 1206, and PTH resistors.
R9-R12 = MotorControllerEagleLibrary:FKN1WSJR-52-4R7; MANUFACTURER_PART_NUMBER: FKN1WSJR524R7; VENDOR: Yageo
SV1-SV4 = con-lstb:MA03-1: PIN HEADER; OC_FARNELL: unknown; OC_NEWARK: unknown
T1 = Teensy_3_and_LC_Series_Boards_v1.1:TEENSY_3.1_ALL_PINS: Footprint for Teensy 3.1 or 3.2 board using all through-holes, i.e. the entire perimeter plus the 4 through-holes inboard (A10,A11,AREF, VUSB)
T2 = zetex:NMOS2: Dual MOS FET; OC_FARNELL: unknown; OC_NEWARK: unknown
U$1-U$4 = MotorControllerEagleLibrary:NTMFS5C426NT1G
U$5 = MotorControllerEagleLibrary:FLYBACK
U$6 = MotorControllerEagleLibrary:TL2575HV-15IKTTR; MANUFACTURER_PART_NUMBER: tl2575hv15_ktt_5; VENDOR: Texas Instruments
U$7 U$10 = MotorControllerEagleLibrary:PA4320: Pulse Inductor, Digikey number 553-3685-1-ND.
U$8 U$11 = MotorControllerEagleLibrary:1N5819
U$9 = ACS770 Current Sensor:ACS770LCB_CURRENTSENSOR
U$12 U$14-U$16 = Connector 732-3204:732-3204-ND_CONNECTOR
U$13 = MotorControllerEagleLibrary:TL2575-05IKTTR; MANUFACTURER_PART_NUMBER: tl257505_ktt_5; VENDOR: Texas Instruments
U$17 = linear:ICL7662CBA

## Board
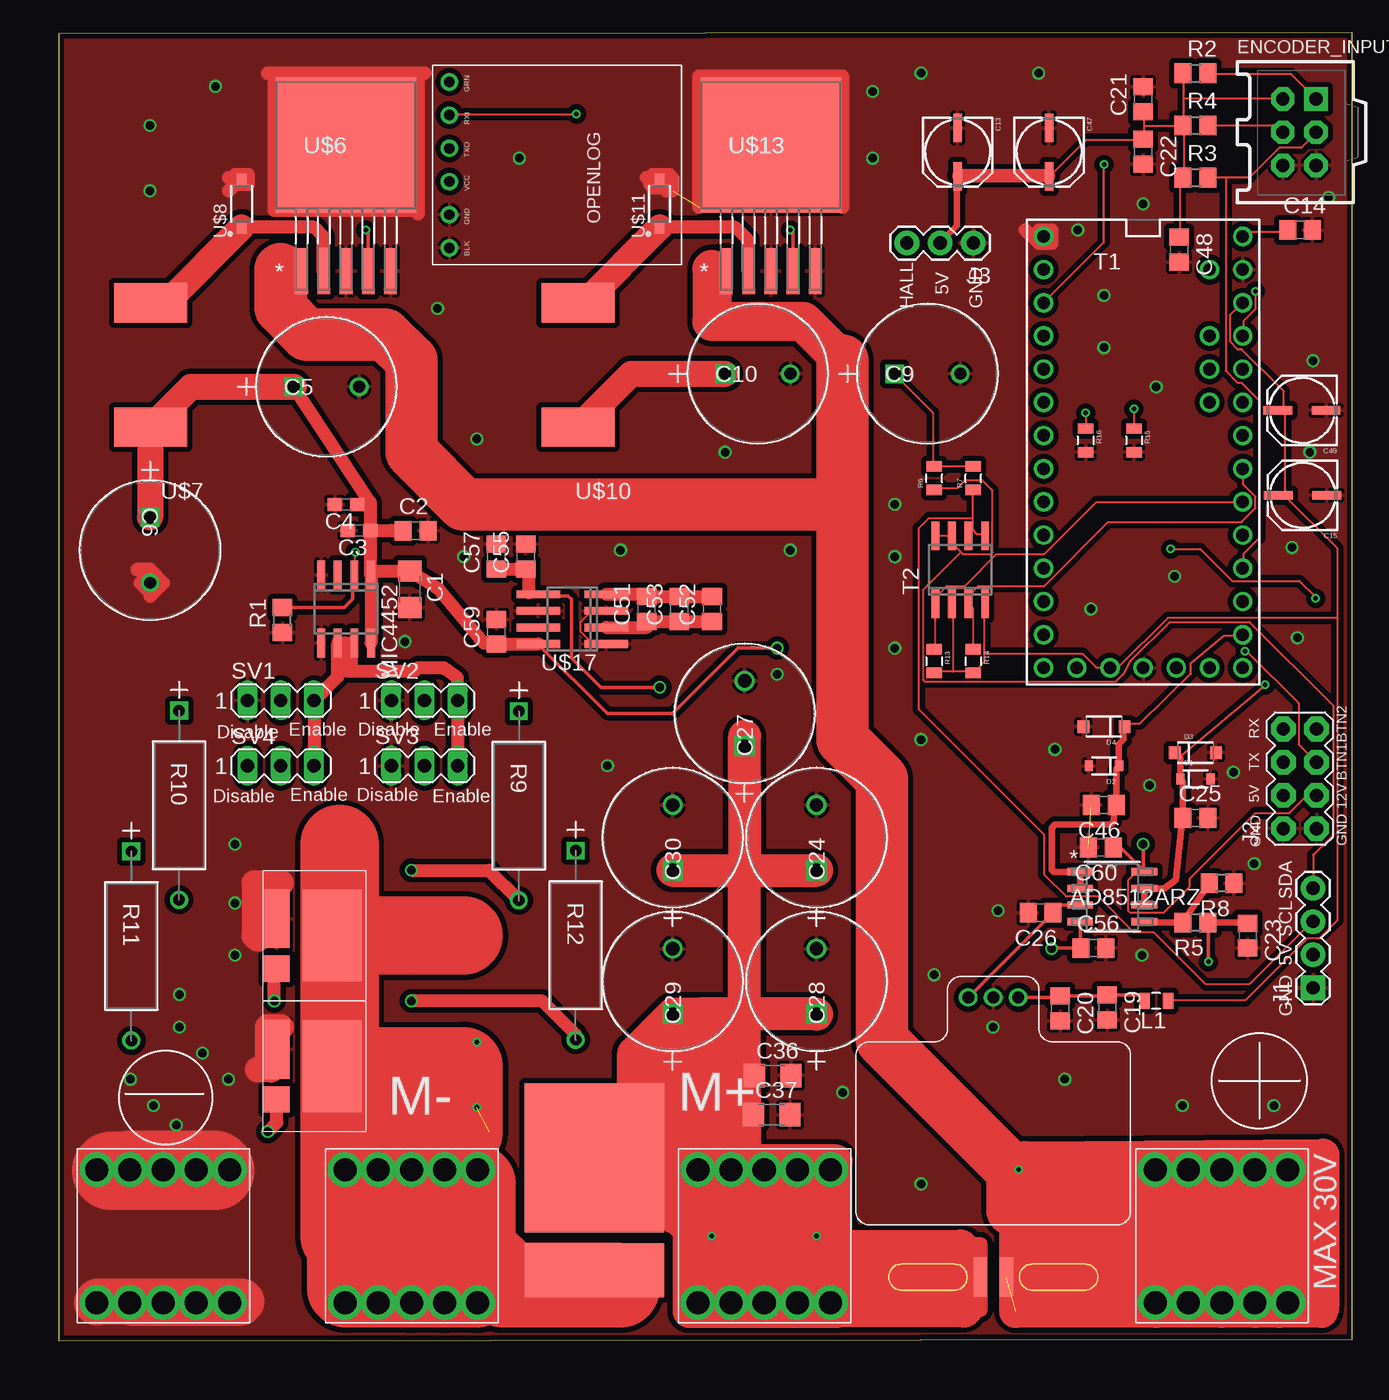
[diagram p7: board, top side]
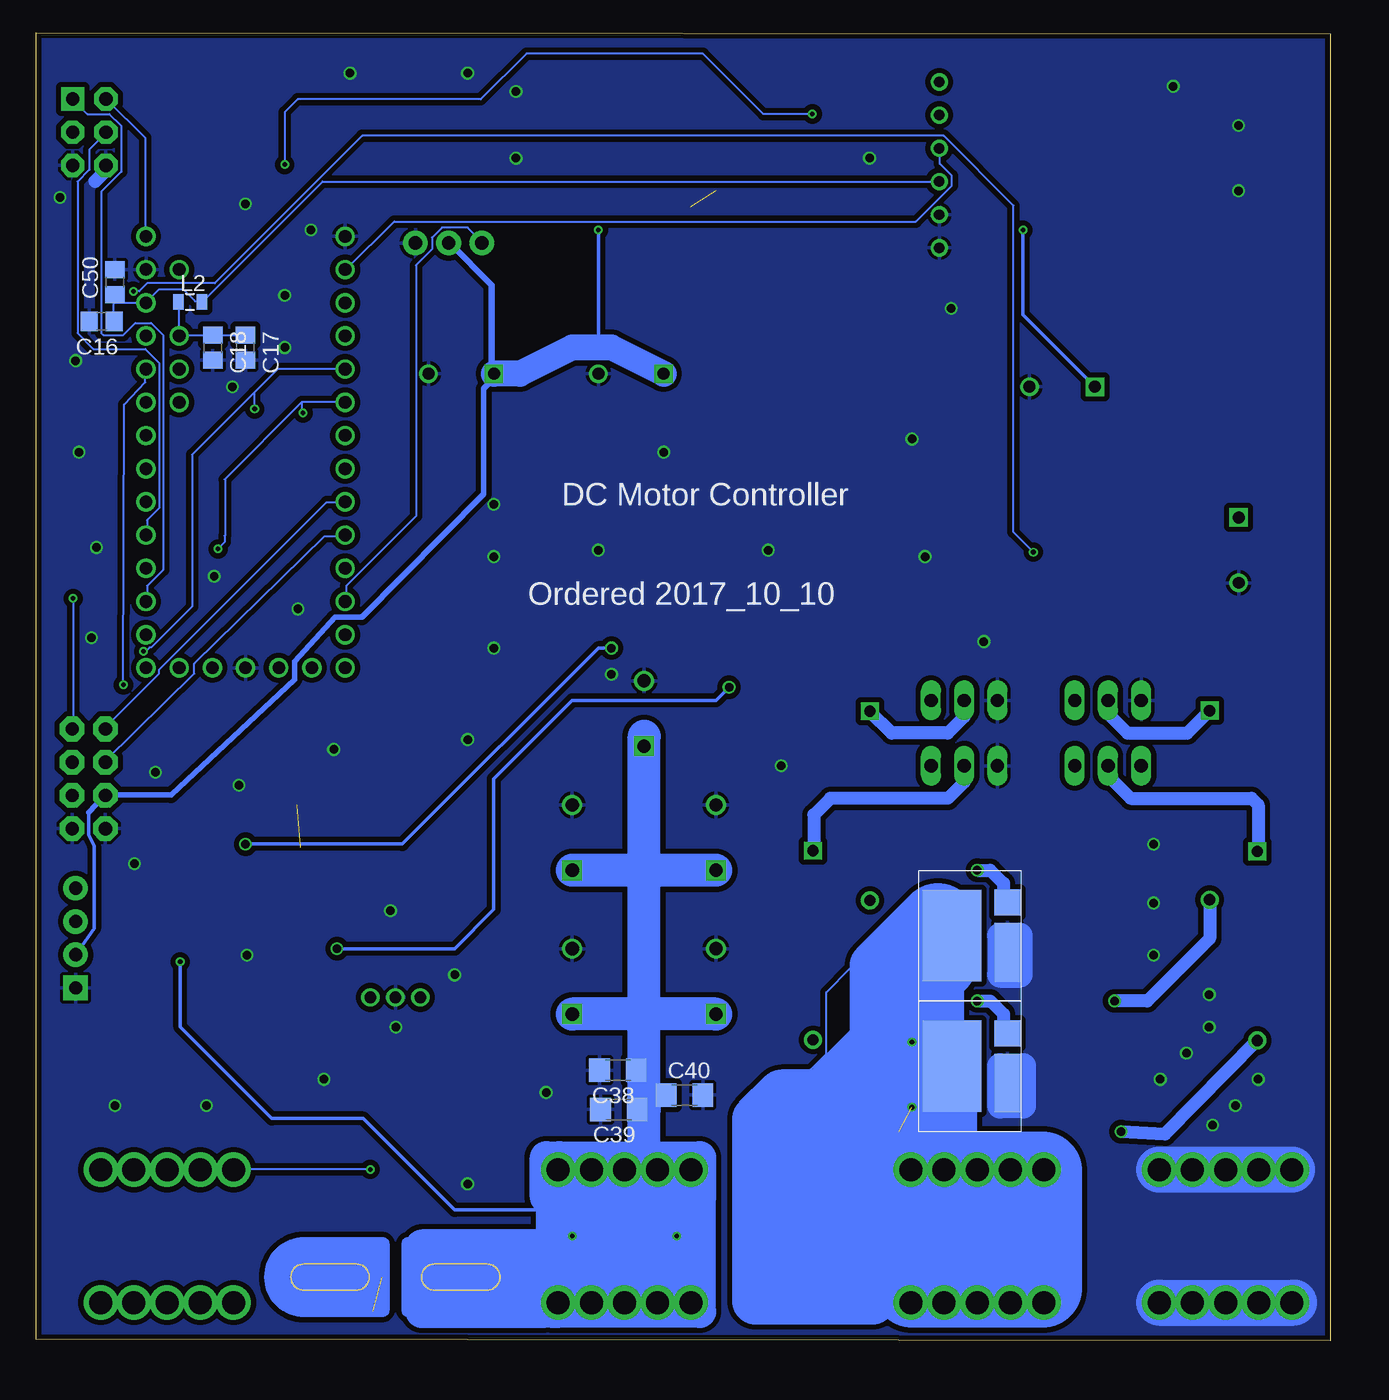
[diagram p8: board, bottom side, seen from below]

Size 99 x 100.1 mm. Coordinates in mm from the lower left corner, seen from the top.
Outline: 0,0 99,0.1 99,100.1 0,100 0,0
Copper layers (1*16): Top 0.035mm / dielectric 1.5mm / Bottom 0.035mm
Design rules "SeeedStudio_2layer_DRU_no_angle_20140221": minimum track width 6mil, minimum drill 12mil, track to track 6mil, track to pad 6mil, pad to pad 6mil, via to via 6mil, smd to smd 0mil, copper to edge 10mil, drill to drill 10mil, minimum pad ring 10mil, minimum via ring 6mil, stop-mask expansion 2mil, vias tented up to drill 100mil, thermal gap 10mil

### Footprints (pad centres in the part's own frame; a part is rotated, then mirrored left to right if it is on the bottom)
D8 = smd 1.981 x 0.559: 1 -2.464,1.905; 2 -2.464,0.635; 3 -2.464,-0.635; 4 -2.464,-1.905; 5 2.464,-1.905; 6 2.464,-0.635; 7 2.464,0.635; 8 2.464,1.905
C1206 = smd 1.6 x 1.8: 1 -1.4,0; 2 1.4,0
C0805 = smd 1.3 x 1.5: 1 -0.95,0; 2 0.95,0
C0603 = smd 1.1 x 1: 1 -0.85,0; 2 0.85,0
CAP_PAN_10X16 = drill 0.914 pad 1.422 square: 1 -5.004,0 | drill 0.914 pad 1.422: 2 0,0
PANASONIC_C = smd 2.2 x 0.65: + 1.9,-0.2; - -1.8,-0.2
CAP_EEUFC_10X25 = drill 1.016 pad 1.524 square: 1 -5.004,0 | drill 1.016 pad 1.524: 2 0,0
SOD-323 = smd 0.63 x 0.83: A 1.15,0; C -1.15,0
SOD-123 = smd 0.9 x 0.95: A 1.575,0; C -1.575,0
90130-1?06 = drill 1.016 pad 1.778 square: 1 -2.54,1.27 | drill 1.016 pad 1.778 octagon: 2 -2.54,-1.27; 3 0,1.27; 4 0,-1.27; 5 2.54,1.27; 6 2.54,-1.27
1X04 = drill 1.016 pad 1.88 square: 1 0,0 | drill 1.016 pad 1.88: 2 2.54,0; 3 5.08,0; 4 7.62,0
2X4 = drill 1.016 pad 1.88 octagon: 1 -3.81,-1.27; 2 -3.81,1.27; 3 -1.27,-1.27; 4 -1.27,1.27; 5 1.27,-1.27; 6 1.27,1.27; 7 3.81,-1.27; 8 3.81,1.27
1X03 = drill 1.016 pad 1.88: 1 0,0; 2 2.54,0; 3 5.08,0
0805 = smd 0.8 x 1.2: 1 -0.9,0; 2 0.9,0
SO-08 = smd 0.6 x 2.2: 1 -1.905,-2.6; 2 -0.635,-2.6; 3 0.635,-2.6; 4 1.905,-2.6; 5 1.905,2.6; 6 0.635,2.6; 7 -0.635,2.6; 8 -1.905,2.6
OPENLOG = drill 0.8: P$1 -6.35,-8.255; P$2 -3.81,-8.255; P$3 -1.27,-8.255; P$4 1.27,-8.255; P$5 3.81,-8.255; P$6 6.35,-8.255
R0805 = smd 1.3 x 1.5: 1 -0.95,0; 2 0.95,0
YAG_FKN50 = drill 0.864 pad 1.372 square: 1 -14.478,0 | drill 0.864 pad 1.372: 2 0,0
MA03-1 = drill 1.016 long: 1 -2.54,0; 2 0,0; 3 2.54,0
TEENSY3-ALL_PINS = drill 0.965: 0 -7.62,13.97; 1 -7.62,11.43; 2 -7.62,8.89; 3 -7.62,6.35; 3.3V 7.62,11.43; 3.3V1 -2.54,-16.51; 4 -7.62,3.81; 5 -7.62,1.27; 6 -7.62,-1.27; 7 -7.62,-3.81; 8 -7.62,-6.35; 9 -7.62,-8.89; 10 -7.62,-11.43; 11 -7.62,-13.97; 12 -7.62,-16.51; 13 7.62,-16.51; 14/A0 7.62,-13.97; 15/A1 7.62,-11.43; 16/A2 7.62,-8.89; 17/A3 7.62,-6.35; 18/A4 7.62,-3.81; 19/A5 7.62,-1.27; 20/A6 7.62,1.27; 21/A7 7.62,3.81; 22/A8 7.62,6.35; 23/A9 7.62,8.89; A10 5.08,6.35; A11 5.08,3.81; AGND 7.62,13.97; AREF 5.08,8.89; GND -7.62,16.51; GND1 0,-16.51; PGM 2.54,-16.51; RESET/DAC 5.08,-16.51; VBAT -5.08,-16.51; VIN 7.62,16.51; VUSB 5.08,13.97
SO8 = smd 0.6 x 2.2: 1 -1.905,-2.6; 2 -0.635,-2.6; 3 0.635,-2.6; 4 1.905,-2.6; 5 1.905,2.6; 6 0.635,2.6; 7 -0.635,2.6; 8 -1.905,2.6
DNF5 = smd 7 x 4.53: DRAIN 0,0.935 | smd 2 x 2: GATE 2.53,-3.3 | smd 4.5 x 2: SOURCE -1.29,-3.3
TO = smd 10.7 x 4.13: ANODE 0,-8.6 | smd 10.7 x 11.4: CATHODE 0,0
KTT5_6P22X6P86 = smd 0.965 x 3.505: 1 -3.4,-9.652; 2 -1.7,-9.652; 3 0,-9.652; 4 1.7,-9.652; 5 3.4,-9.652 | smd 10.719 x 10.363: 6 0,0
INDUCTOR_SMD_FOOTPRINT = smd 5.6 x 3: 1 2.8,1.5; 2 2.8,11
SOD3715X135N = smd 1 x 0.75: A 1.8,0; C -1.8,0
ACS770LCB_CURRENTSENSOR = drill 0.9: PIN1 -1.91,-21.4; PIN2 0,-21.4; PIN3 1.91,-21.4 | smd 1 x 3: PIN4 1,0; PIN5 -1,0
732-3204-ND = drill 1.76: P$1 -5.08,5.08; P$2 -2.54,5.08; P$3 0,5.08; P$4 2.54,5.08; P$5 5.08,5.08; P$6 5.08,-5.08; P$7 2.54,-5.08; P$8 0,-5.08; P$9 -2.54,-5.08; P$10 -5.08,-5.08
SO08 = smd 0.6 x 3.302: 1 -1.905,-2.6; 2 -0.635,-2.6; 3 0.635,-2.6; 4 1.905,-2.6; 5 1.905,2.6; 6 0.635,2.6; 7 -0.635,2.6; 8 -1.905,2.6

### Placement (x,y rotation side)
AD8512ARZ  80.64,33.98 0 top
C1  26.87,57.51 270 top
C2  27.32,61.98 0 top
C3  23,62 180 top
C4  22,64 180 top
C5  23,73 0 top
C6  7,58 270 top
C9  69,74 0 top
C10  56,74 0 top
C13  69,91 270 top
C14  95,85 0 top
C15  95.25,64.5 180 top
C16  94,78 180 bottom
C17  83,76 270 bottom
C18  85.5,76 270 bottom
C19  80.25,25.5 270 top
C20  76.65,25.42 270 top
C21  83,95 90 top
C22  83,91 270 top
C23  91,31 270 top
C24  58,41 90 top
C25  87,40 0 top
C26  75.15,32.75 180 top
C27  52.5,50.5 90 top
C28  58,30 90 top
C29  47,30 90 top
C30  47,41 90 top
C36  54.66,20.3 0 top
C37  54.58,17.3 0 top
C38  54.5,20.7 180 bottom
C39  54.42,17.7 180 bottom
C40  49.41,18.8 0 bottom
C46  80,41 180 top
C47  76,91 270 top
C48  85.75,83.5 270 top
C49  95.2,71 180 top
C50  93,81 90 bottom
C51  45,56 90 top
C52  50,56 90 top
C53  47.5,56 90 top
C55  35.75,60 90 top
C56  79.2,30.05 0 top
C57  33.5,60 90 top
C59  33.5,54.25 90 top
C60  79.75,37.75 180 top
D1  87,43 0 top
D2  80,44 180 top
D3  87,45 0 top
D4  80,47 180 top
ENCODER_INPUT  94.96,92.48 270 top
J1  96,27 90 top
J2  95,43 90 top
J3  70,84 180 top
L1  84,26 180 top
L2  87.25,79.5 0 bottom
MIC4452  22,56 180 top
O1  38.16,89.98 270 top
R1  17.13,55.14 90 top
R2  87,97 0 top
R3  87,89 0 top
R4  87,93 0 top
R5  87,32 180 top
R6  67,66 90 top
R7  70,66 90 top
R8  89,35 180 top
R9  35.22,33.69 270 top
R10  9.22,33.74 270 top
R11  5.57,22.97 270 top
R12  39.57,23.02 270 top
R13  67,52 270 top
R14  70,52 270 top
R15  82.3,68.9 270 top
R16  78.6,68.9 270 top
SV1  17,49 0 top
SV2  28,49 0 top
SV3  28,44 0 top
SV4  17,44 0 top
T1  83,68 0 top
T2  69,59 0 top
U$1  20,21 270 top
U$2  20,31 270 top
U$3  28,31 90 bottom
U$4  28,21 90 bottom
U$5  41,14 0 top
U$6  22,91.5 0 top
U$7  9.85,80.92 180 top
U$8  14,87 90 top
U$9  71.53,4.87 180 top
U$10  42.55,80.92 180 top
U$11  46,87 90 top
U$12  54,8 0 top
U$13  54.5,91.5 0 top
U$14  8,8 0 top
U$15  89,8 0 top
U$16  27,8 0 top
U$17  39.31,55.22 90 top

### Tracks (layer width: path | path; a pad name or v marks a point on that pad's centre or on a via)
3.3V_POWER_REGULATED
  Top 0.152: 68.43,51.21 69.95,51.21 R14.2 70.1,51.21 70.87,51.97 70.87,52.58 | 68.43,51.21 67.06,51.21 R13.2 | 68.43,51.21 68.43,56.39 T2.2 | 70.87,52.58 70.87,56.39 T2.4 | 70.87,52.58 78.33,52.58 79.4,51.51 80.31,51.51 T1.3.3V1 80.47,51.51 81.08,51.51 84.89,55.32 97.84,55.32 | 97.84,55.32 97.84,60.66 93.88,64.62 C15.+ 93.88,64.77 93.88,71.17 C49.+ 93.73,71.32 93.73,72.69 90.53,75.89 90.22,75.89 89.61,76.5 89.61,78.49 90.53,79.4 T1.3.3V | 97.84,55.32 97.84,32.16 96.47,30.79 95.56,30.79 90.83,26.06 85.04,26.06 L1.1
  Bottom 0.152: 93.12,79.4 93.12,80.01 C50.1 93.12,79.4 | 93.12,79.4 93.12,78.03 C16.1 | 93.12,79.4 90.68,79.4 T1.3.3V 90.53,79.55 89.61,80.47 87.78,80.47 86.87,79.55 86.41,79.55 L2.2 86.26,79.55 77.11,88.7 30.02,88.7 O1.P$4
5V_POWER_REGULATED  (via drill 0.35)
  Top 0.152: C14.1 94.03,84.89 90.98,84.89 90.68,84.58 T1.VIN | C48.1 85.8,84.58 85.8,88.7 85.95,88.85 R3.1 86.11,89 86.11,92.96 R4.1 | 83.06,92.96 83.06,94.03 C21.1 | 83.06,92.96 83.06,92.05 C22.1 82.91,91.9 78.64,91.9 75.89,89.15 C47.+ 75.74,89.15 | 83.06,92.96 85.95,92.96 R4.1 | 86.11,95.1 86.11,93.12 R4.1 | 86.11,95.1 86.11,96.93 R2.1 | 86.11,95.1 93.57,95.1 ENCODER_INPUT.2 | R7.2 69.95,66.9 67.06,66.9 R6.2 66.9,66.9 66.9,71.02 64.01,73.91 C9.1 | 68.73,89 C13.+ 68.89,89.15 | 67.51,84.12 J3.2
  Top 0.254: v56,85 56.2,84.8 U$13.4
  Top 0.508: 68.73,89 68.73,85.34 67.51,84.12
  Top 1.016: 68.89,89.15 75.74,89.15
  Top 2: U$10.2 43.83,74 C10.1
  Bottom 0.152: T1.VIN 90.68,84.58 90.68,92.05 93.57,94.94 ENCODER_INPUT.2 | 95.76,29.88 95.86,29.57 J1.2 | 93.88,41.6 J2.4 93.73,41.76 | 64.16,74.98 C9.1 64.47,73.15 | 67.36,83.97 J3.2
  Bottom 0.254: 56,76 v56,85 | 95.76,29.88 94.59,31.55 94.59,37.86 95,38.71 95,40.44
  Bottom 0.406: 93.88,41.6 95,40.44 | 93.73,41.76 88.7,41.76 79.24,50.61 79.24,51.97 76.14,55.37 74.08,55.37 64.77,64.78 64.77,72.85 64.47,73.15
  Bottom 0.508: 64.16,74.98 64.16,80.77 67.36,83.97
  Bottom 2: C10.1 55,76 56,76 58,76 62,74 C9.1
12V_POWER_REGULATED  (via drill 0.35, 0.65)
  Top 0.152: J2.3 96.16,41.6 95.4,41.6 94.18,40.39 91.59,40.39 86.56,35.36 86.56,34.75 84.58,32.77 81.99,32.77 81.84,32.92 81.84,35.2 82.75,36.12 AD8512ARZ.8
  Top 0.254: v23.5,85 23.7,84.8 U$6.4 | U$17.8 36.71,53.29 42,48 47,48 52,53 v55,53 | 83,36 v83,38 | 83,36 83,35.99 AD8512ARZ.8 | C60.1 81.25,37.75 83,36
  Top 0.508: C4.1 23.85,64.15
  Top 1: MIC4452.1 MIC4452.8 | C3.1 23.85,58.66 MIC4452.1 | C3.1 25.39,62 C2.1 | MIC4452.1 24.21,58.91 C1.1 29,57.58 32.2,53.75 32.58,53.38 33.42,53.38 C59.1 33.52,53.31 U$17.8 | C5.1 23.85,64.15 C3.1
  Top 2: C5.1 10.13,73 U$7.2 7,69.87 C6.1
  Bottom 0.254: C5.1 23.5,78.5 v23.5,85 | v55,53 56,53 71,38 v83,38
BUTTON1  (via drill 0.35)
  Top 0.152: v90.8,52.76 90.94,52.76 94.9,48.8 94.9,45.64 J2.5 | v82.3,71.3 R15.1
  Bottom 0.152: T1.3 80.55,74.35 82.35,72.55 | 82.35,72.55 87.1,67.8 87.1,56.19 90.22,53.06 90.33,53.06 90.8,52.6 v90.8,52.76 | 82.35,72.55 82.35,71.35 v82.3,71.3
BUTTON2  (via drill 0.35)
  Top 0.152: v85.1,60.6 87.36,60.6 89.82,58.15 94.95,58.15 96.2,56.9 v96.2,56.8 | v78.6,71 R16.1
  Bottom 0.152: T1.4 78.69,71.81 | 78.69,71.81 84.55,65.95 | 84.55,65.95 84.6,65.9 | 84.55,65.95 84.55,61.65 84.6,61.6 84.6,61.1 v85.1,60.6 | v96.2,56.8 96.2,46.88 J2.7 | 78.69,71.81 78.69,71.09 v78.6,71
CURRENT_FEEDBACK
  Top 0.152: T1.14/A0 90.53,53.95 89.15,53.95 86.66,51.86 86.66,51.05 82.75,47.24 81.69,47.24 D4.C
  Top 0.508: AD8512ARZ.2 AD8512ARZ.1 76.11,35.88 76,36 76,39.25 76.25,39.5 80.5,39.5 80.75,39.75 80.75,40.8 C46.1 80.95,43.8 D2.C 81.15,45.65 81.5,46 81.5,46.92 D4.C
CURRENT_SENSOR_OUTPUT
  Top 0.254: U$9.PIN3 C26.1 76.69,33.34 AD8512ARZ.3
ENCODER_A
  Top 0.152: R2.2 88.09,96.93 94.34,96.93 96.16,95.1 ENCODER_INPUT.1
  Bottom 0.152: T1.15/A1 90.53,56.69 90.53,57.76 89.31,58.98 89.31,76.96 90.22,77.88 91.44,77.88 92.35,76.96 93.88,76.96 94.03,77.11 94.03,87.94 92.51,89.46 92.51,92.96 93.42,93.88 95.1,93.88 96.16,94.94 ENCODER_INPUT.1
ENCODER_B
  Top 0.152: 89.31,89 91.14,89 93.42,91.29 95.1,91.29 96.16,92.35 ENCODER_INPUT.3 | 89.31,89 88.09,89 R3.2 | 89.31,89 89.31,74.22 90.22,73.3 90.53,73.3 91.9,71.93 91.9,61.42 90.68,60.2 90.68,59.13 T1.16/A2
FET_DRIVER_SIGNAL
  Top 0.254: 21.36,50.83 21.49,50.83
  Top 1: SV4.3 SV1.3 21.36,50.83 21.36,51.88 | SV3.3 SV2.3 30.5,49.04 30.5,50.75 29.6,51.4 29.5,51.5 27.5,51.5 27.25,51.25 22,51.25 21.36,51.88 | MIC4452.6 21.36,52 21.36,51.88
GND  (via drill 0.65)  (2 unrouted)
  Top 0.152: 16,22.4 16.61,22.4 U$1.SOURCE | U$17.3 41.91,55.78 40.69,55.78 39.93,55.02 39.93,54.25 40.84,53.34 41.91,53.34 U$17.1
  Top 1.016: 16,97 28,97 27.5,96.75 27.5,86.5 | 27.5,86.25 27.5,86.5 | 27.5,86.5 16.5,86.5 16.5,96.25 | 60,86.75 60,96.75 49,96.75 49,86.75 | 75,85 76,85 76,84 75,84 74,85 | 45,89 45.25,89 45.5,89.25 46.75,89.25 47,89 47,88 46.5,88 46.25,88.25 45.5,88.25 45.25,88.5 | 13,89 13.25,89 13.5,89.25 14.5,89.25 14.5,88.5 13.5,88.5 13,88 | 6,59 7,59 8,58 7,57 7,57.25 6.25,58 6.5,58.25
  Top 2: 16,21 16,22.4 16,24 17,24 | 16.25,20.75 15.25,20.75 | 15.25,30.75 15,31 15,35 17,35
  Top 3.5: U$14.P$9 13.92,2.92 14,3 3,3 U$14.P$10
  Top 6: U$14.P$2 11.92,13.08 12,13 4.02,13
  Bottom 0.152: U$3.SOURCE 23.75,29.72 | 25.25,19.66 24.84,19.66 U$4.SOURCE
  Bottom 1.016: 94,90 94,89.25 94.5,88.75
  Bottom 2: 25.25,31 25.25,28 23.75,28 23.75,29.72 23.75,31 | 23.5,21 23.5,18 25.25,18 25.25,19.66 25.25,21
  Bottom 3.5: U$14.P$1 U$14.P$5 | U$14.P$6 2.77,2.92
  other vias: 5.5,20 7.25,18 9,16.5 9.25,26.5 9.25,24 13.5,38 13.5,33.5 11,22 13,20 13.5,29.5 42,44 64,60 64,53 64,64 51,68 32,69 56,60.5 55,51 29,79 7,93 35.25,90.5 94.4,60.7 94.8,53.8 66,46 67,28 71.5,24 77,20 86,18 93,18 60,19 66,12 43,60.5 31,60 26.5,53.5 76.25,45.25 71.9,32.9 96,75 97.2,87.5 66,97 75,97 84,73 80,76 80,80 62.3,95.6 62.3,90.5 83,87 78,85 91.5,36.5 89.9,43.5 83.5,42.5 95.75,68 85.4,58.5 79,56 7,88 12,96 82.9,29.5
  pour Top (isolate 0.4): -1,103 102,103 102,-2 -2,-2 -2,103
  pour Bottom (isolate 0.4): -1,102 101,102 101,-1 -1,-1
HALL
  Bottom 0.152: T1.10 75.29,56.69 75.29,57.76 69.95,63.09 69.95,82.3 68.73,83.52 68.73,84.43 67.97,85.19 65.99,85.19 64.92,84.12 J3.3
INDEX
  Top 0.152: R4.2 88.09,92.96 93.12,92.96 93.57,92.51 ENCODER_INPUT.4
  Bottom 0.152: T1.17/A3 90.53,61.72 90.53,62.79 89.61,63.7 89.61,74.83 90.68,75.89 94.64,75.89 95.86,77.11 95.86,88.7 94.94,89.61 94.94,91.14 93.73,92.35 ENCODER_INPUT.4
INPUT_POWER(+)  (via drill 0.35)
  Top 0.152: U$12.P$6 59.13,3.05 59.13,2.25 | C37.1 53.19,17.37 52.5,17.37 | C29.1 46.94,24.99 C29.1 | C36.1 53.34,20.27 52.5,20.27 | R5.1 87.94,32 88,32 | C28.1 58.06,24.99 C28.1 | C30.1 47.09,35.97 47.09,36
  Top 0.254: C24.1 52.5,36 | C27.1 52.5,43 | C30.1 | v88,29 88,32 | 50.75,19 52.25,19 52.5,18.75
  Top 0.508: R5.1 90.8,32.02 C23.1
  Top 2.54: 52.5,36 52.5,20.27 52.5,18.75 52.5,17.37 52.5,13.25 | 52.5,36 52.5,43 52.5,46.25 | C28.1 49,25 | C30.1 47.09,36 52.5,36 | 52.5,36 C24.1 | 44,19 44,22 C29.1 49,25 | 49,25 50.75,23.25 50.75,19 50.75,15.5 | 46,15.5 50.75,15.5 | 46,15.5 46,22 46.25,22.25 47.25,22.25 48.5,23.5 49,23.5 49.75,22.75 49.75,16 47.25,16 47.25,20.5 48.5,20.5 49,21 49,17.5 | U$12.P$2 51.46,14.79 50.75,15.5 | U$5.CATHODE 44.25,14 44.75,13.5 44.75,14.25 46,15.5 | 47,14 47,9.5 47.25,9.5 48,8.75 48.25,8.75 48.5,8.5 48.25,8.25 48.25,2.25 59.13,2.25 59.5,2.25 59.5,2.5 59.5,13.75 49.75,13.75 49.25,13.25 49.25,4 49.5,3.75 57,3.75 57.5,4.25 57.5,11.25 56.75,12 51.75,12 51,11.25 51,5.75 51.5,5.25 55,5.25 56,6.25 56,10 55.75,10.25 53.75,10.25 52.75,9.25 52.75,7 53,6.75
  Top 3: 54,7 69,7 69,5 | 69,5 69,2.75 69.25,2.5 59.5,2.5 59.5,4.5 60,5 69,5
  Bottom 0.152: C39.1 53.03,17.68 52.5,17.68 | U$12.P$6 59.13,3.05 59.13,2.25 | 52.58,25 52.58,24.99 52.5,24.99 | 52.58,36 52.58,36.12 52.5,36.12
  Bottom 0.254: 51.92,18.8 C40.1 | 51.92,18.8 C39.1 | 51.92,18.8 53.1,19.98 C38.1 | 59.5,6 68.25,6 69.5,7.25 | v88,29 88,24 81,17 74,17 67,10 55,10 55,10.25 | v50,8 50,9.5 50.5,10 | 55,10.25 56.75,8.5 | 55,11 55,10.25 | U$12.P$10 48.25,2.25
  Bottom 2.54: C29.1 52.58,25 C28.1 | 52.5,46.25 52.5,36.12 52.5,24.99 52.5,17.68 52.5,13.25 52.33,13.08 U$12.P$2 | C30.1 52.58,36 C24.1 | U$12.P$1 U$12.P$2 | U$12.P$3 U$12.P$2 | U$12.P$3 U$12.P$4 U$12.P$5 59.08,13.92 59,14 | 54.92,14 48.25,14 | 48.25,14 48.25,11 | 48.25,11 55,11 60,11 60,14 59,14 | 59,14 54.92,14 | 54.92,14 U$12.P$3 | 49,13 49,13.25 48.25,14 | 48.25,11 48.25,2.25 59.13,2.25 59.5,2.25 59.5,6 59.5,10 55,10 50.5,10 50.5,4.25 | 58,4.25 50.5,4.25 | 58,4.25 v58,8 58,9.75 51.25,9.75 51.25,5.5 51.5,5.25 56.75,5.25 56.75,8.5 56.5,8.75 52.25,8.75 52.25,7.5 52.5,7.25 55,7.25 55,7 | 50.5,4.25 U$12.P$9 U$12.P$8 | U$12.P$7 58,4.25 | U$12.P$6 59.48,2.29 | 59,7 60,7 60.25,7.25 69.5,7.25 69.5,2.25 60.25,2.25 60.25,5.25 60.5,5.5 68.5,5.5 68.5,4.5 61.75,4.5 61.5,4.25
MOTOR_OUTPUT_(+)  (via drill 0.35)  (1 unrouted)
  Top 0.152: U$15.P$10 83.97,3.05 83.97,2.25 | U$15.P$8 89,3.05 89,2.25 | U$15.P$7 91.59,3.05 91.59,2.25 | U$15.P$6 94.03,3.05 93.43,2.25 | U$15.P$1 83.97,13.11 83.97,12.5 | U$15.P$2 86.41,13.11 86.41,12.5 | U$15.P$3 89,13.11 89,12.5 | U$15.P$4 91.59,13.11 91.59,12.5 | U$15.P$5 94.03,13.11 94.03,12.5 | v73.46,13.11 73,13
  Top 0.254: U$13.1 50.85,81.85 50,81
  Top 0.508: U$6.1 17.15,81.85 17,82 | U$13.1 50.15,81.85 50,82
  Top 2.54: 74,14 96.75,14.2 96.75,2.95 96.65,2.25 93.43,2.25 91.59,2.25 89,2.25 83.97,2.25 73.25,2.25 73.25,12.5 83.97,12.5 86.41,12.5 89,12.5 91.59,12.5 94.03,12.5 95.25,12.5 95.25,3.5 78.75,3.5 77.75,4.5 | 77.75,10.75 93.75,10.75 94,10.5 94,6 93.5,5.5 80,5.5 79.75,5.75 79.75,9.25 79,10 92.5,10 92.5,7.75 92.75,7.5 80.5,7.5 82,9 92.75,9 92.75,8 82.75,8
  Top 3: 60,75 57,78 50,78 50,82
  Top 4: 73,10 73,13 63,23 63,43 60,46 60,64 | 60,64 60,75 | 60,64 31,64 27,68 27,75 25,77 19,77 17,79 17,82 | 77.75,10.75 77.75,4.5
  Bottom 0.152: U$15.P$10 83.97,3.05 86.41,3.05 U$15.P$9 | v73.46,13.11 83.82,13.11 U$15.P$1
MOTOR_OUTPUT_(--)  (via drill 0.35)  (1 unrouted)
  Top 0.152: 21.5,21.03 21.03,21.03 U$1.DRAIN 21.49,23.01 22,21 | U$16.P$10 21.95,3.05 22,4 24.54,3.05 U$16.P$9 | 32,4 32.16,3.05 U$16.P$6 | U$16.P$8 26.98,3.05 26.98,4 | U$16.P$1 21.95,13.11 22,12 24.54,13.11 U$16.P$2 | U$16.P$3 26.98,13.11 26.98,12 | U$16.P$7 29.57,3.05 29.57,4 | U$16.P$4 29.57,13.11 29.57,12 | U$16.P$5 32.16,13.11 32,12 | 25.88,16.12 25.6,15.85 25.6,13 | U$2.DRAIN 21.03,30.94 21.5,30.94 | 24.38,31 24.38,31.09 21.5,31.09 | U$5.ANODE 41,5.49 41,4.5 | v32,22.86 31,21
  Top 6: 22,13 25.6,13 31,13 31,6 | 31,6 31,5 32,4 29.57,4 26.98,4 22,4 22,12 26.98,12 29.57,12 32,12 32,7 | 32,7 31,6 | 31,6 25,6 24,7 24,10 29,10 29,9 34,4 43,4 43,4.25 42.75,4.5 41,4.5 34.5,4.5 32,7 | 21.5,8 21.5,21.03 21.5,30.94 21.5,31.09 21.5,38 | 25,17 25.88,16.12 26,16 31,16 31,21 22,21 | 22,31 24.38,31 31,31
  Bottom 0.152: U$4.DRAIN 28.96,21.03 30,21.03 | 30,15.54 30.02,15.54 30.02,13 | U$3.DRAIN 28.96,30.94 30,29 | 35,28.5 36.73,28.5 38.56,26.67 38.56,21.95 39.78,20.73 39.78,19 | v32,22.86 30,22
  Bottom 3.5: 30,19 39.78,19 42,19 44,17 44,3 35,3 35,14 33,16 41,16 41,6 42,5 38,5 38,14 | 30,29 30,26 36,20 38,20 33,25 33,24 35,22 35,28.5 35,28.75 30.75,33
  Bottom 6: 30,9 30,15.54 30,21.03 30,22 31,23 31,28 30,29 30,32 | 30,8 30,6 32,4 22,4 22,13 30.02,13 31,13 31,6 26,6 24,8 27,8 29,10
  other vias: 32,17.86
N$1
  Top 1: U$6.2 20.25,81.9 20.25,84.5 19.55,85.2 U$8.C | 8.22,79.42 U$7.1
  Top 1.016: 20.25,81.88 U$6.2
  Top 2: U$8.C 8.22,79.42
N$2  (via drill 0.65)
  Top 1: v16.5,26 16.5,28.27 U$2.GATE
  Bottom 1: R10.2 9.22,30.78 14,26 v16.5,26
N$3
  Bottom 1: SV1.2 17,48 15.5,46.5 10.94,46.5 R10.1
N$4
  Top 1: U$13.2 52.75,81.9 52.75,84.25 51.8,85.2 U$11.C | 40.22,79.42 U$10.1
  Top 2: U$11.C 40.22,79.42
N$5
  Bottom 1: SV3.2 28,42.75 29.25,41.5 38.25,41.5 39.5,40.25 39.5,37.57 R12.1
N$6
  Top 0.254: U$9.PIN1 76.55,26.27 C20.1 80.17,26.37 C19.1 82.65,26.45 L1.2
N$7
  Top 0.508: 86,32 R5.2 | 86,32 83.16,32.02 AD8512ARZ.5 | R8.2 86.05,32.05 86,32
N$8
  Bottom 1: SV4.2 17,43.25 15.25,41.5 6,41.5 5.5,41 5.5,37.52 R11.1
N$9
  Bottom 0.152: C17.1 83.06,76.96 85.5,76.96 C18.1 85.65,76.96 87.94,76.96 T1.AREF 88.09,76.96 88.09,79.4 L2.1
N$10  (via drill 0.65)
  Top 1: v16,16 16.7,16.7 U$1.GATE
  Bottom 1: R11.2 12.64,15.8 v16,16
N$11  (via drill 0.65)
  Top 1: v27,36 32.91,36 R9.2
  Bottom 1: v27,36 26,36 25,35 25,33.83 U$3.GATE
N$12  (via drill 0.65)
  Top 1: R12.2 39.57,23.43 37,26 v27,26
  Bottom 1: v27,26 26,26 25,25 25,23.83 U$4.GATE 24.7,23.3 25,23
N$13
  Bottom 1: SV2.2 28,47.75 29.25,46.5 33.55,46.5 R9.1
N$14
  Top 1: U$17.2 45,54.59 C51.1 C53.1 C52.1
N$15
  Top 1: U$17.4 45,57.12 C51.2 C53.2 C52.2
N$16
  Top 2.54: 55,7 52,10
N$18
  Top 4: 76,13 76,10 75,9
N$19
  Top 0.152: 69.95,62.03 69.95,62.94 | 69.95,62.94 69.95,65.08 R7.1 | 69.95,62.03 69.65,61.72 T2.6 | 69.95,62.03 70.26,61.72 70.87,61.72 T2.5 | 69.95,62.94 66.6,62.94 65.84,62.18 65.84,48.31 75.44,38.71 75.44,35.66 77.11,33.98 79.55,33.98 82.3,31.24 83.82,31.24 87.78,27.28 91.14,27.28 95.86,32 J1.3
N$20
  Top 0.152: 69.04,60.35 68.43,60.96 68.43,61.57 T2.7 68.28,61.57 67.21,61.57 T2.8 | 69.04,60.35 69.19,60.2 71.32,60.2 71.48,60.35 71.48,65.08 70.71,65.84 69.34,65.84 68.73,65.23 67.06,65.23 R6.1 | 69.04,60.35 66.14,57.45 66.14,50.6 66.29,50.44 80.92,50.44 81.53,51.05 82.03,52.01 85.04,55.02 91.14,55.02 97.54,48.62 97.54,38.71 96.01,37.19 96.01,34.75 J1.4
N$21
  Top 1.016: 22.4,53.4 22.4,51.5 | 22.4,51.4 22.4,51.5 | 22.4,51.5 21.9,52 21.9,53.4
OUTPUT_12NEG  (via drill 0.65)
  Top 0.254: 36,57.25 36.59,57.25 U$17.5 36.84,57 39,57 39.25,56.75 39.25,52.25 41.5,50 v46,50 | 78,31.9 AD8512ARZ.4 78.18,30.12 C56.1 76.05,30.05 v76,30
  Top 1: C57.1 C55.1 36,58.8 36,57.25
  Bottom 0.254: v46,50 47,49 58,49 64,43 64,33 67,30 v76,30
RX1
  Bottom 0.152: O1.P$3 29.87,91.14 29.87,90.07 28.96,89.15 28.96,88.39 31.7,85.65 71.63,85.65 75.29,81.99 T1.0
RX3
  Bottom 0.152: T1.7 75.44,64.16 76.81,64.16 89.61,51.36 89.61,51.05 93.73,46.94 J2.8
SCL0
  Top 0.152: R14.1 69.95,53.03 69.95,56.08 69.65,56.39 T2.3 69.65,56.54 69.65,57 70.41,57.76 75.44,57.76 80.31,62.64 90.53,62.64 91.59,63.7 91.59,64.62 90.68,65.53 90.68,66.6 T1.19/A5
SDA0
  Top 0.152: R13.1 67.06,53.03 67.06,56.39 T2.1 67.21,56.54 67.21,57 67.97,57.76 69.34,57.76 71.78,60.2 75.44,60.2 79.4,64.16 90.53,64.16 T1.18/A4
SUPPLY_VOLTAGE  (via drill 0.35)
  Top 0.152: v92.34,50.19 85.95,44.81 85.85,44.58
  Top 0.508: AD8512ARZ.6 AD8512ARZ.7 84.61,34.62 85.5,35.25 86,39.95 C25.1 86.05,42.8 D1.C 85.85,44.58 D3.C
  Bottom 0.152: v92.34,50.19 92.29,71.64 90.68,73.35 90.68,74.22 T1.22/A8
TEENSY_FET_DRIVER_SIGNAL  (via drill 0.35)
  Top 0.152: v91.59,80.31 91.59,78.94 90.68,78.03 90.68,76.96 T1.23/A9 | v22.71,60.35 22.71,58.67 MIC4452.2
  Top 0.254: R1.2 21.84,56.09 22.5,56.75 22.5,58.47 MIC4452.2
  Bottom 0.152: v91.59,80.31 91.14,80.31 90.53,80.92 85.34,80.92 74.07,92.2 29.57,92.2 24.23,86.87 24.23,61.87 v22.71,60.35
TX1  (via drill 0.35)
  Top 0.152: v39.62,93.88 30.02,93.88 O1.P$2 | 75.29,79.55 T1.1 80,84.05 v80,90
  Bottom 0.152: v39.62,93.88 43.38,93.88 48,98.5 61.5,98.5 65,95 79,95 80,94 v80,90
TX3
  Bottom 0.152: T1.8 75.44,61.57 76.96,61.57 86.92,51.81 86.92,51.05 93.73,44.35 J2.6

### Text on the board
tPlace: 5V | HALL | GND | Disable | Enable | Disable | Enable | RX | BTN2 | TX | BTN1 | Disable | Enable | Disable | Enable | 5V | 12V | GND | GND | SDA | SCL | 5V | GND | M+ | M- | MAX 30V
bPlace: DC Motor Controller | Ordered 2017_10_10